# EAGLE design Hutschienenmoped_24V (EAGLE 9.6.2)
Assembly variants: ECU Type I non terminated, b

## Sheet 1 of 6
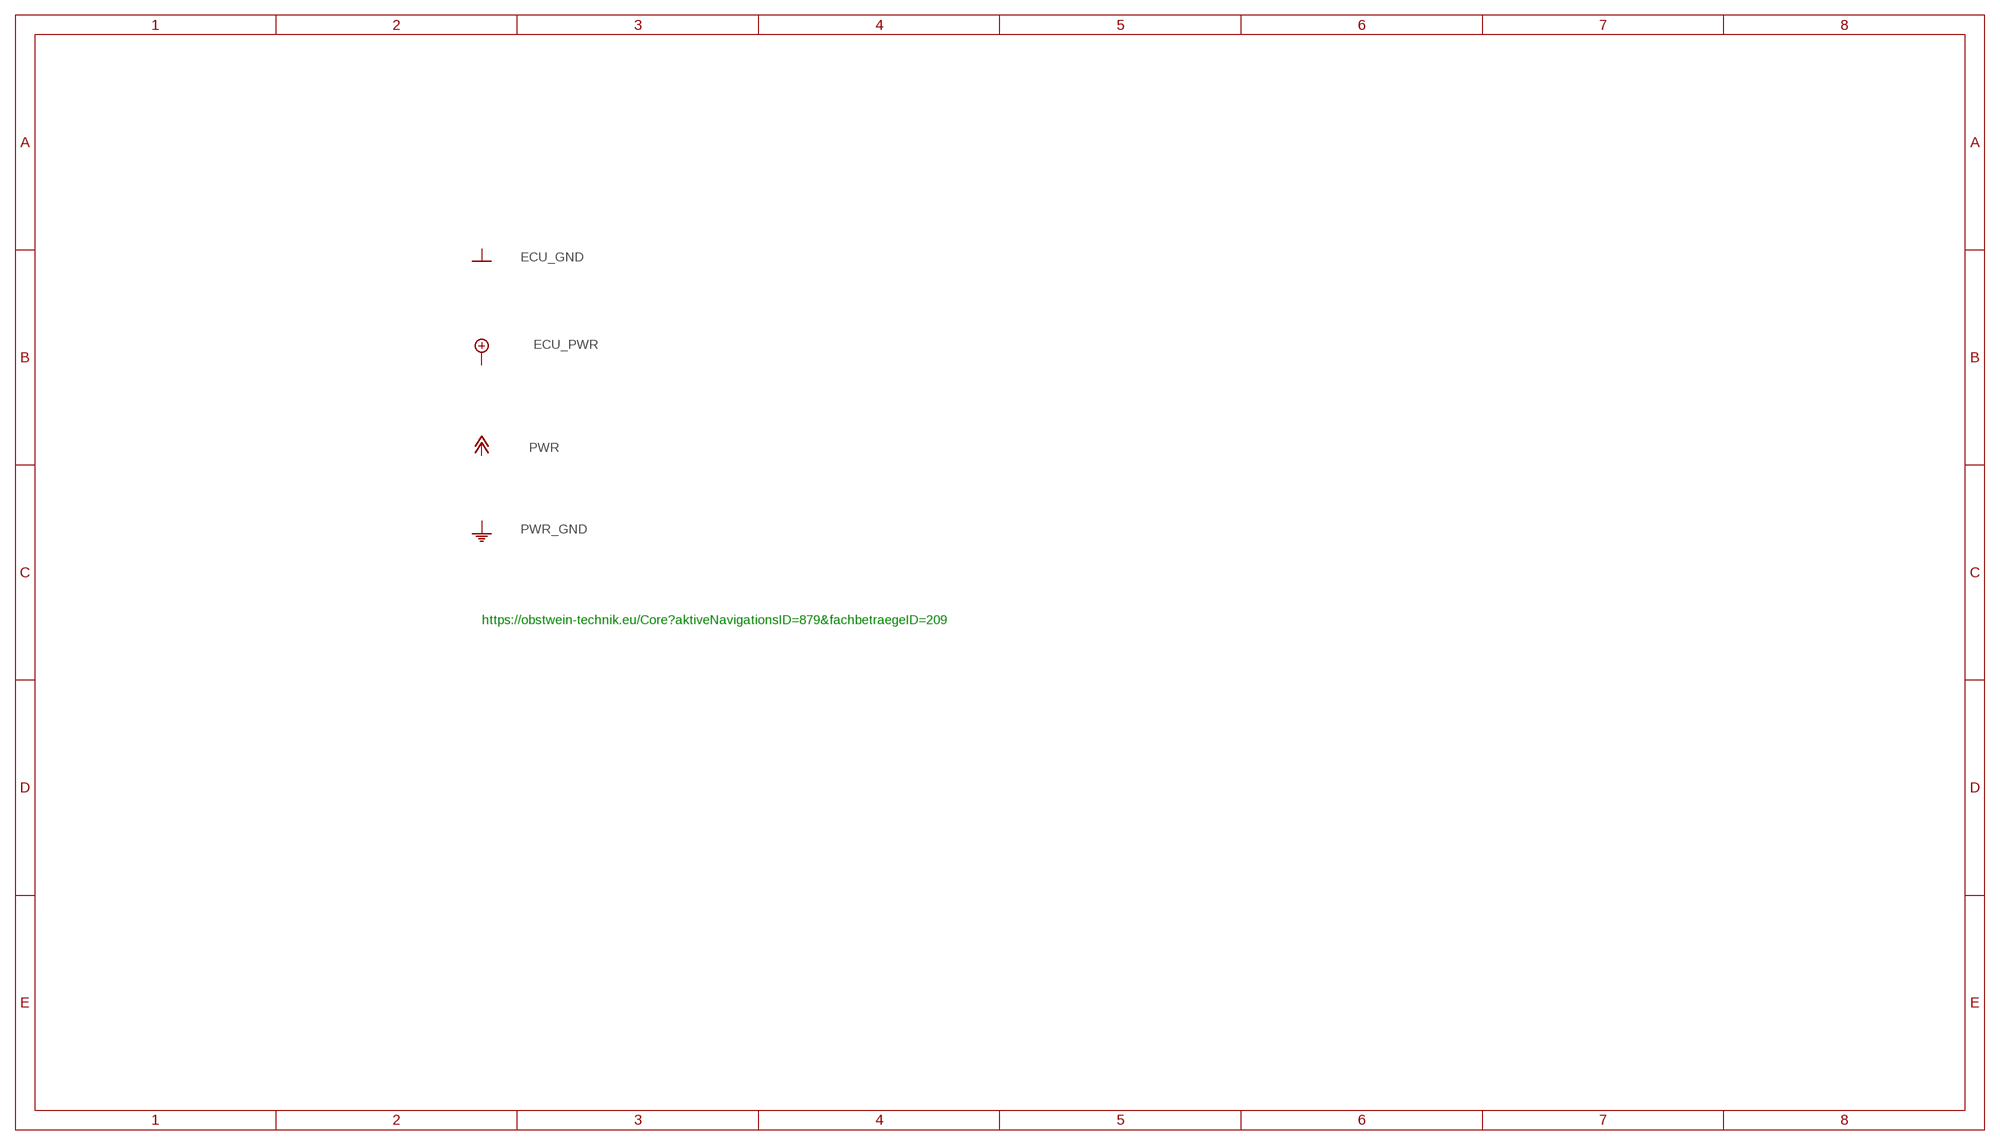
[diagram p0: schematic, sheet 1]

### Notes on the sheet
- https://obstwein-technik.eu/Core?aktiveNavigationsID=879&fachbetraegeID=209

## Sheet 2 of 6
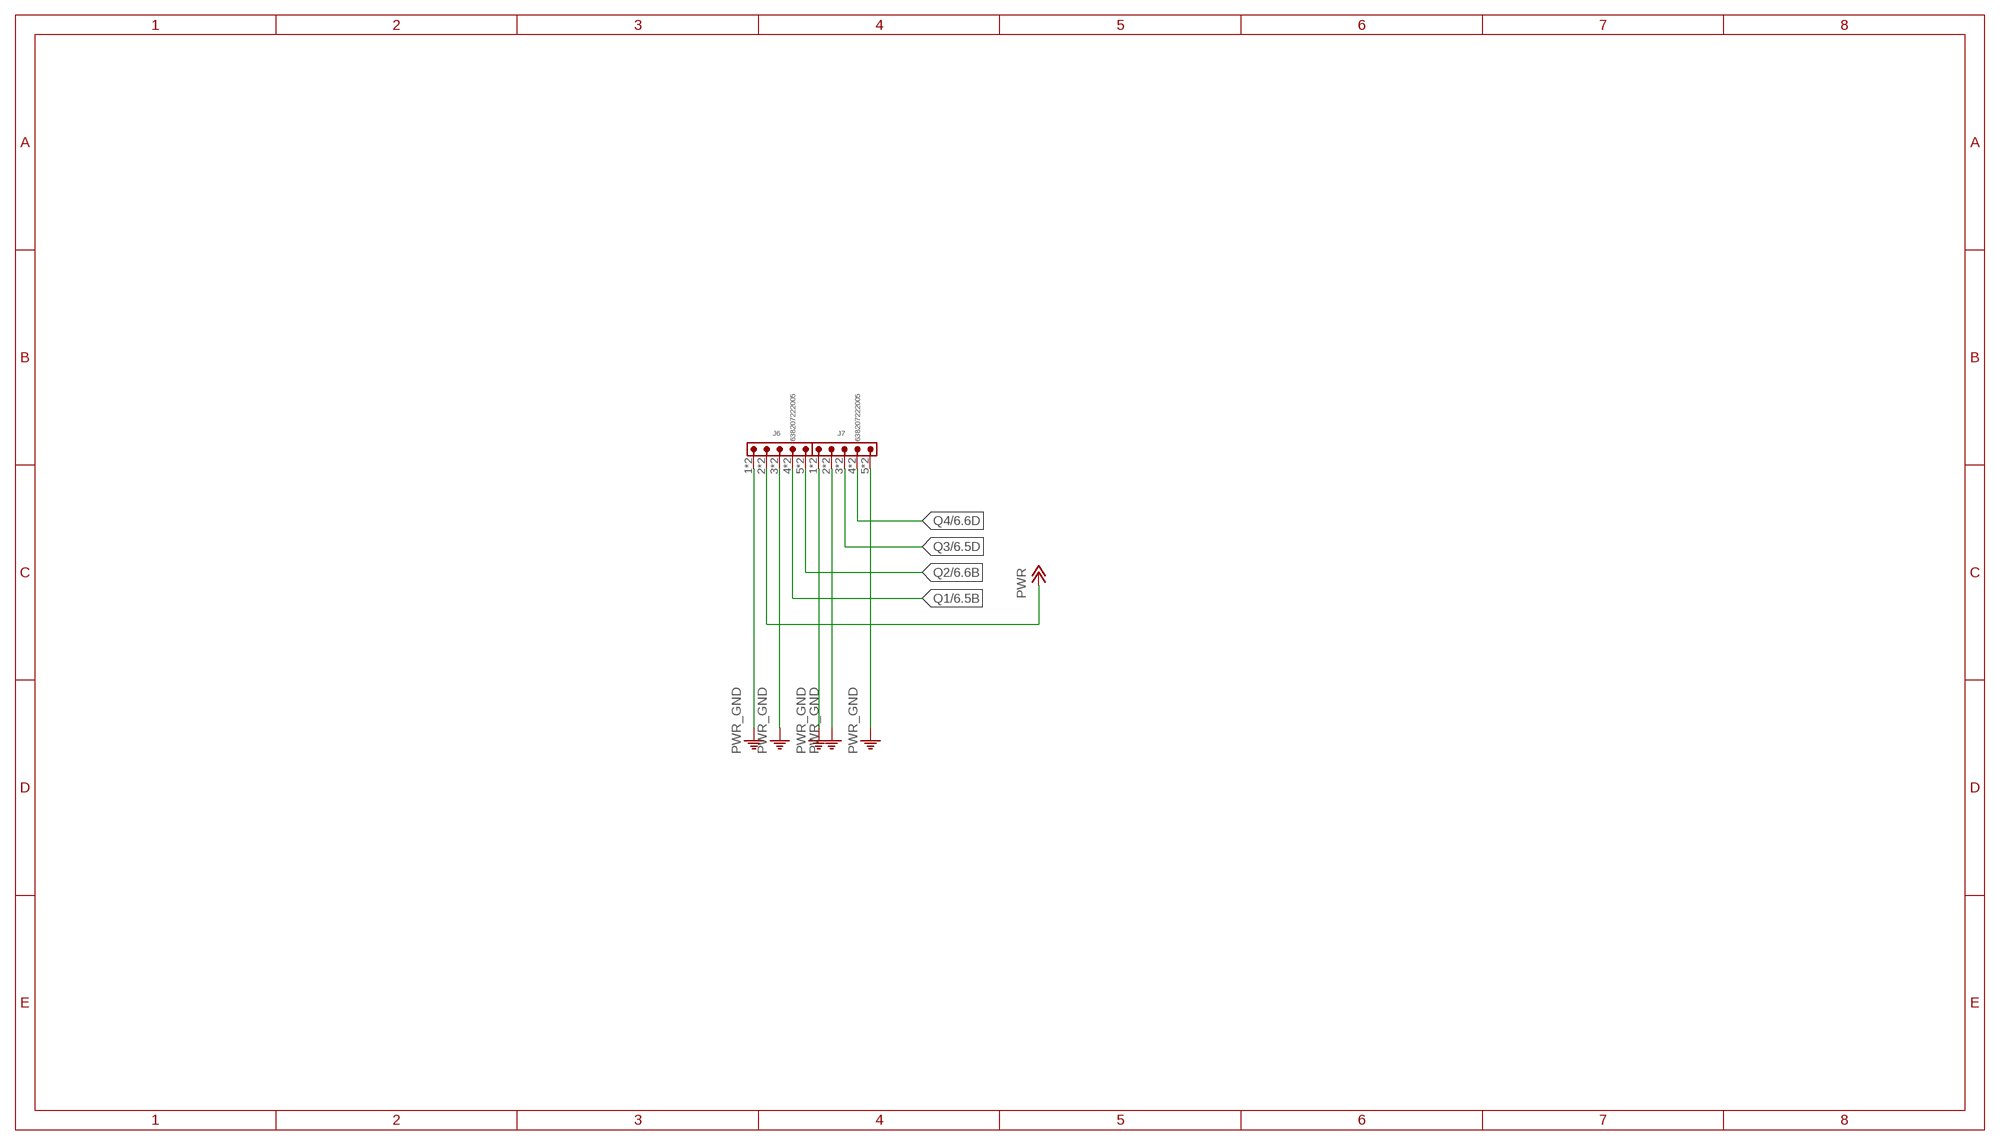
[diagram p1: schematic, sheet 2]

### Parts
J6  638207222005  638207222005  [638207222005]
J7  638207222005  638207222005  [638207222005]

### Nets
PWR: J6.2 J6.A2 ; also sheet 6
PWR_GND: J6.1 J6.3 J6.A1 J6.A3 J7.1 J7.2 J7.5 J7.A1 J7.A2 J7.A5 ; also sheet 6
Q1: J6.4 J6.A4 ; also sheet 6
Q2: J6.5 J6.A5 ; also sheet 6
Q3: J7.3 J7.A3 ; also sheet 6
Q4: J7.4 J7.A4 ; also sheet 6

## Sheet 3 of 6
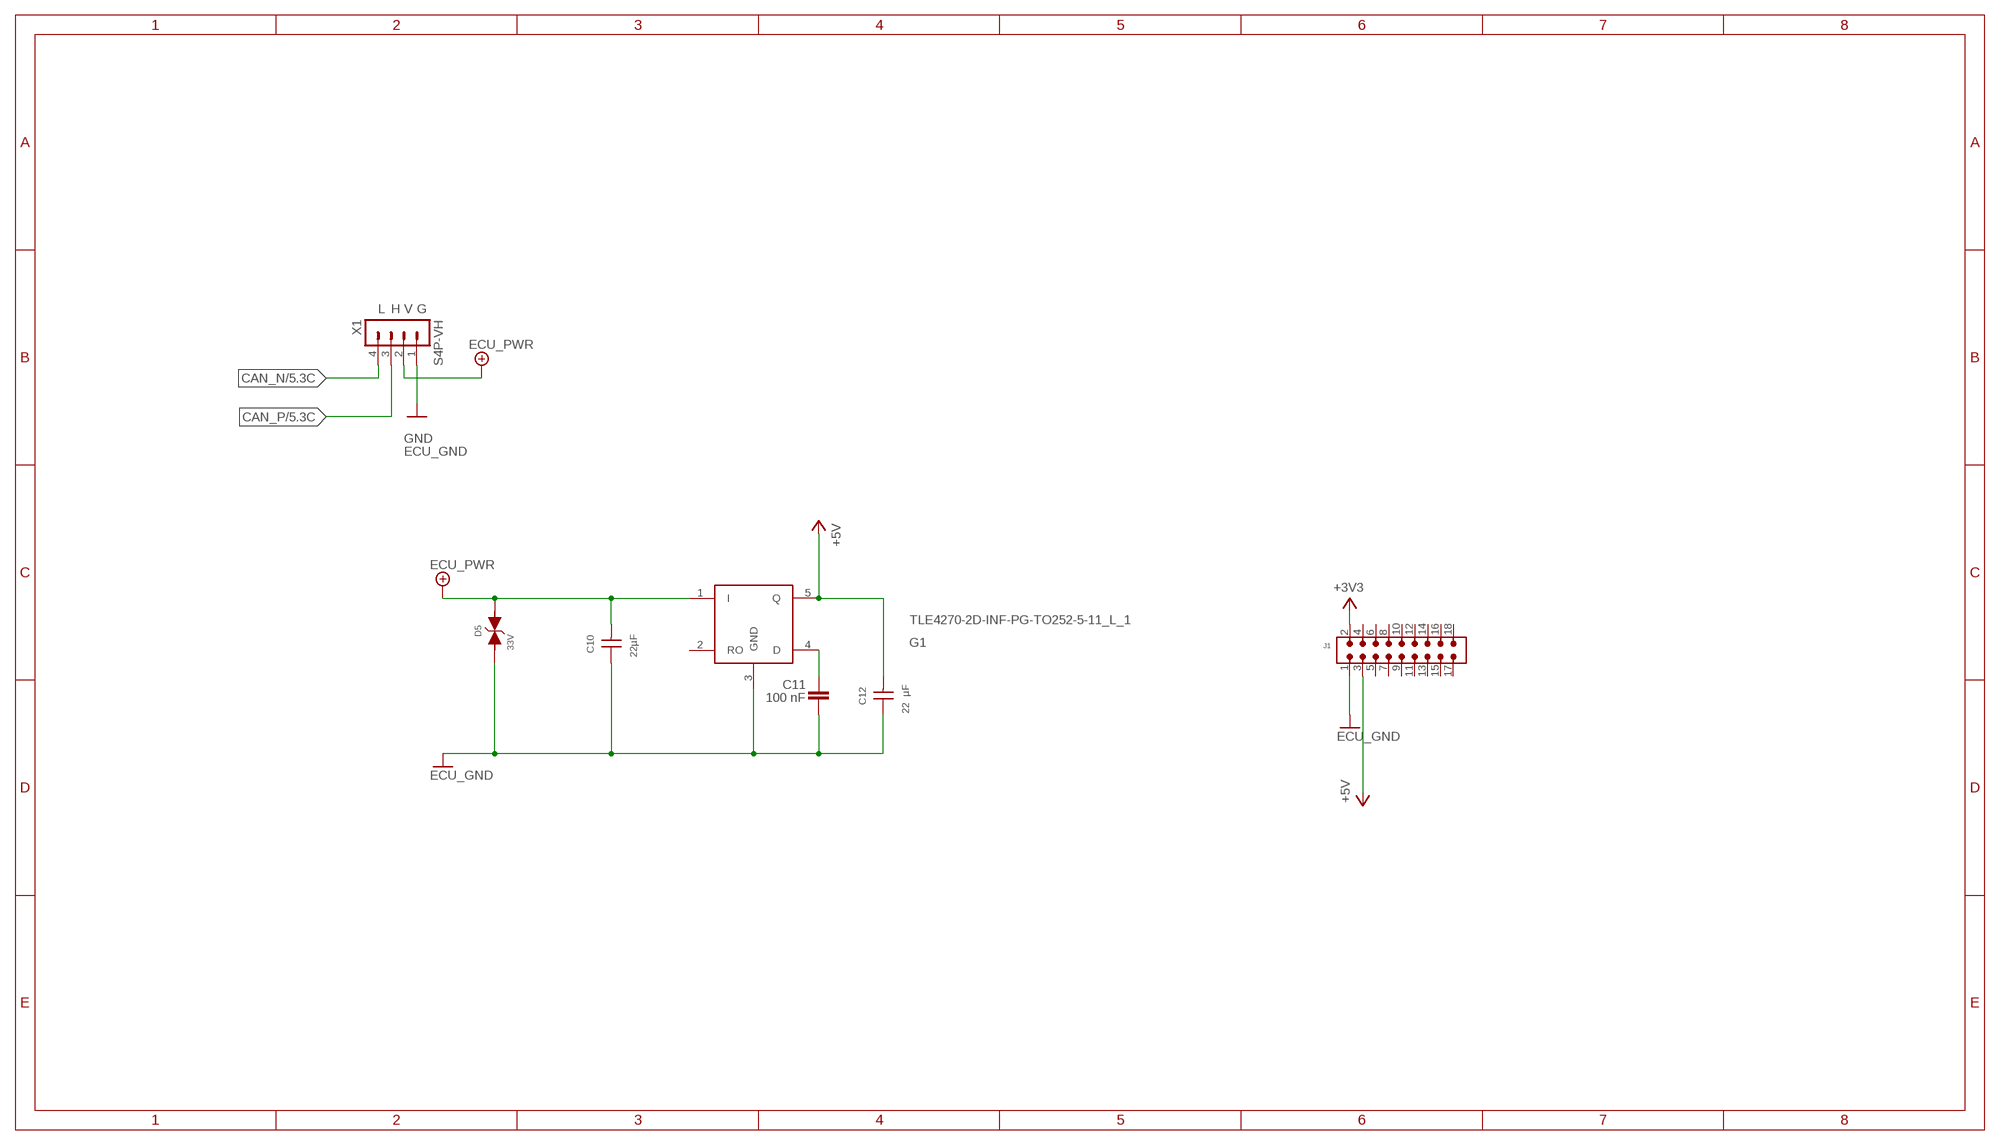
[diagram p2: schematic, sheet 3]

### Parts
C10  22µF  WCAP-CSGP_1210_H2.5_885012109014_25V(DC)  [WCAP-CSGP_1210_H2.5]
C11  100 nF  WCAP-CSGP_0402_885012205037_16V(DC)  [WCAP-CSGP_0402]
C12  22 µF  WCAP-CSGP_0805_H1.25_885012107011_10V(DC)  [WCAP-CSGP_0805_H1.25_R]
D5  33V  WE-TVSP_DO-214AB_3000W_BI_824551331  [WE-TVSP_DO-214AB_BIDIRECTIONAL]
G1  TLE4270-2D-INF-PG-TO252-5-11_L_1  [INF-PG-TO252-5-11_L_1PRIMARY]
J1  6130XX21121_61301821121  [61301821121]
X1  S4P-VH  [S4P-VH]

### Nets
+3V3: J1.2 ; also sheet 4,5
+5V: C12.2 G1.5(Q) J1.3 ; also sheet 4,5
CAN_N: X1.4 ; also sheet 5
CAN_P: X1.3 ; also sheet 5
ECU_GND [GND]: C10.1 C11.2 C12.1 D5.1 G1.3(GND) J1.1 X1.1 ; supply symbol labelled GND ; also sheet 4,5,6
ECU_PWR: C10.2 D5.2 G1.1(I) X1.2 ; also sheet 6
N$7: C11.1 G1.4(D)
Unconnected: G1.2(RO) J1.4 J1.5 J1.6 J1.7 J1.8 J1.9 J1.10 J1.11 J1.12 J1.13 J1.14 J1.15 J1.16 J1.17 J1.18

### Notes on the sheet
- L | H | V | G

## Sheet 4 of 6
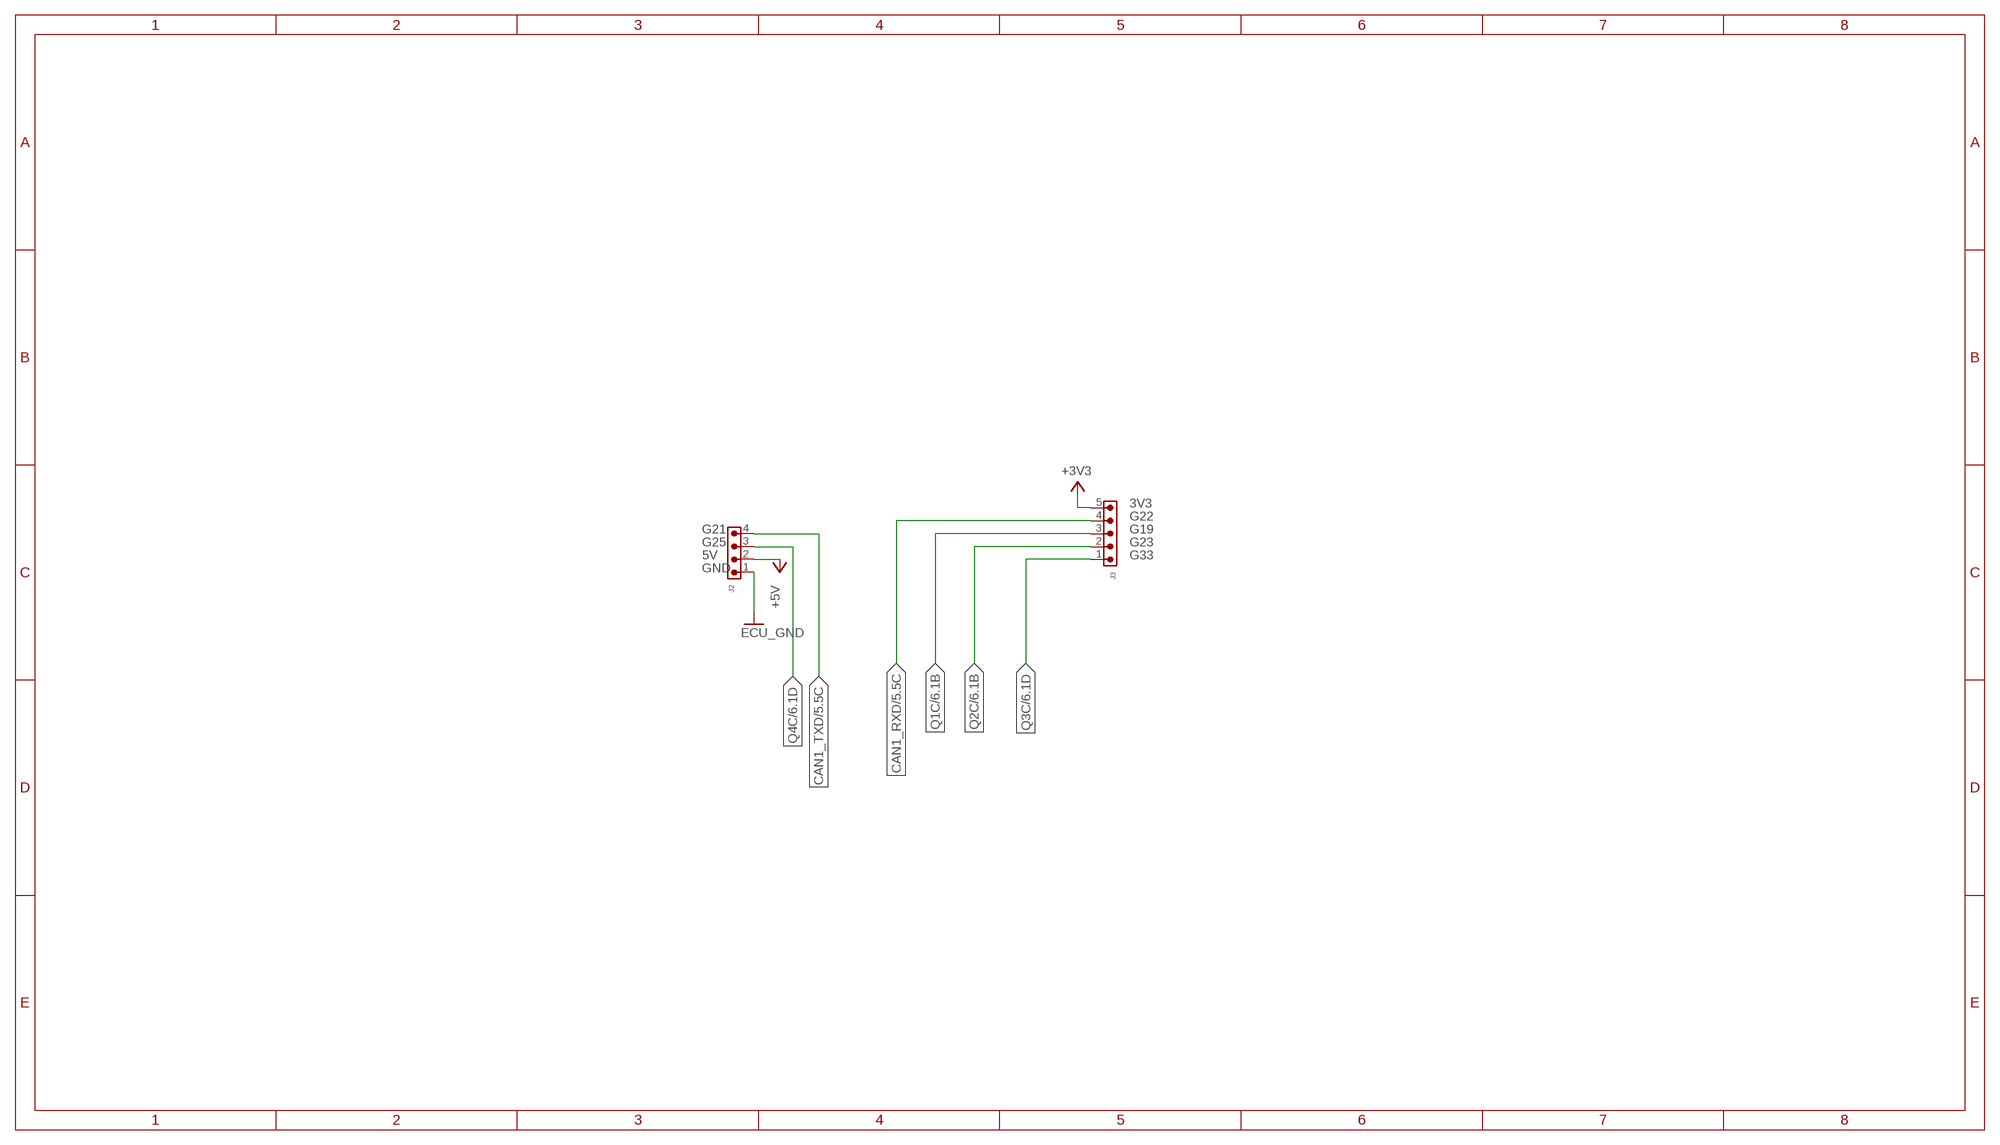
[diagram p3: schematic, sheet 4]

### Parts
J2  6130XX11121_61300411121  [61300411121]
J3  6130XX11121_61300511121  [61300511121]

### Nets
+3V3: J3.5 ; also sheet 3,5
+5V: J2.2 ; also sheet 3,5
CAN1_RXD: J3.4 ; also sheet 5
CAN1_TXD: J2.4 ; also sheet 5
ECU_GND [GND]: J2.1 ; also sheet 3,5,6
Q1C: J3.3 ; also sheet 6
Q2C: J3.2 ; also sheet 6
Q3C: J3.1 ; also sheet 6
Q4C: J2.3 ; also sheet 6

### Notes on the sheet
- 3V3
- G22
- G21 | G19
- G25 | G23
- 5V | G33
- GND

## Sheet 5 of 6
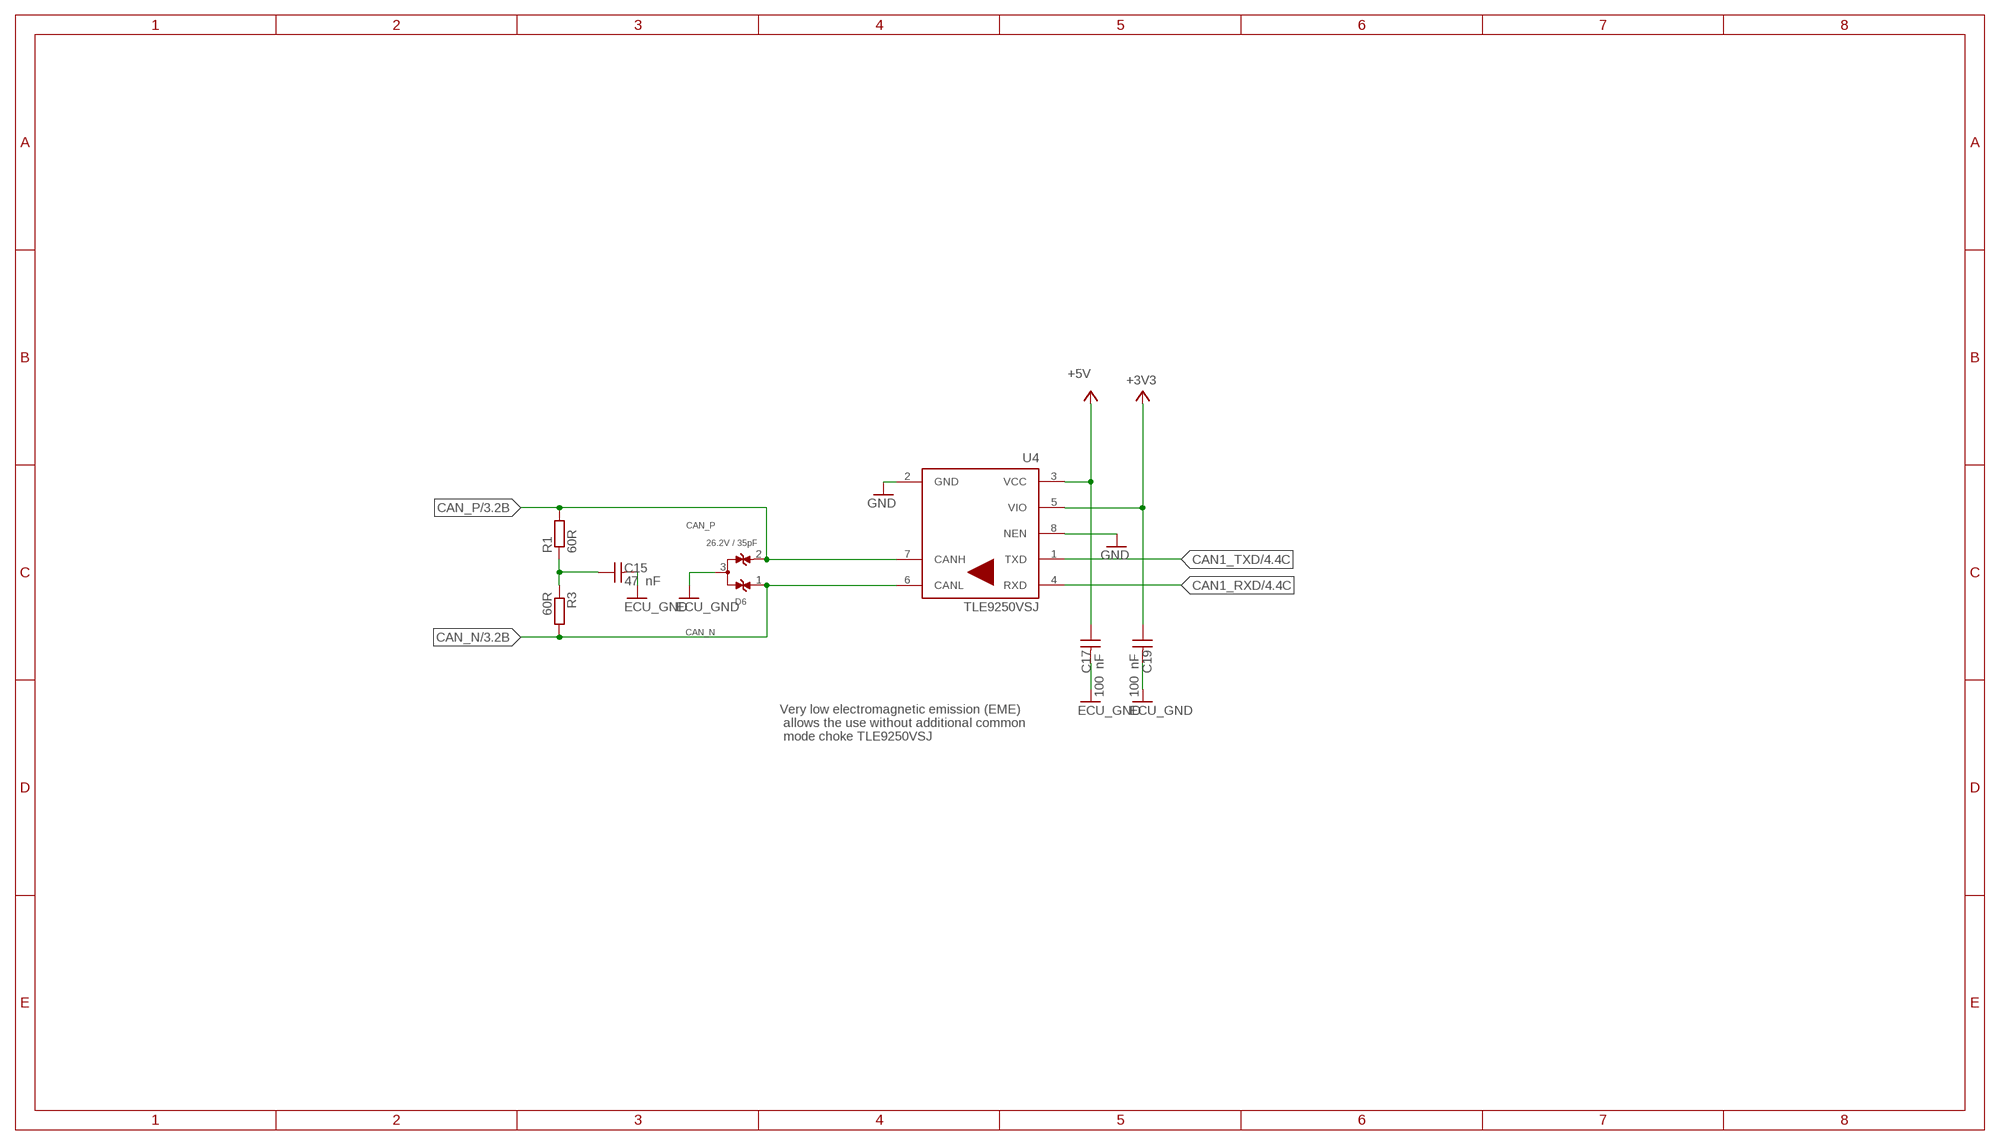
[diagram p4: schematic, sheet 5]

### Parts
C15  47 nF  WCAP-CSGP_0805_H0.8_885012207096_50V(DC)_R  [WCAP-CSGP_0805_H0.8_R]
C17  100 nF  WCAP-CSGP_0805_H0.8_885012207098_50V(DC)_R  [WCAP-CSGP_0805_H0.8_R]
C19  100 nF  WCAP-CSGP_0805_H0.8_885012207098_50V(DC)_R  [WCAP-CSGP_0805_H0.8_R]
D6  26.2V / 35pF  WE-TVS_SOT23-3L_824098024  [WE-TVS_SOT23-3L]
R1  60R  R-EU_R0805  [R0805]
R3  60R  R-EU_R0805  [R0805]
U4  TLE9250VSJ  [SOIC127P602X173-8N-V]

### Nets
+3V3: C19.1 U4.5(VIO) ; also sheet 3,4
+5V: C17.1 U4.3(VCC) ; also sheet 3,4
CAN1_RXD: U4.4(RXD) ; also sheet 4
CAN1_TXD: U4.1(TXD) ; also sheet 4
CAN_N: D6.1 R3.2 U4.6(CANL) ; also sheet 3
CAN_P: D6.2 R1.2 U4.7(CANH) ; also sheet 3
ECU_GND [GND]: C15.2 C17.2 C19.2 D6.3 U4.2(GND) U4.8(NEN) ; supply symbol labelled GND ; also sheet 3,4,6
N$17: C15.1 R1.1 R3.1

### Notes on the sheet
- Very low electromagnetic emission (EME)
   allows the use without additional common
   mode choke TLE9250VSJ

## Sheet 6 of 6
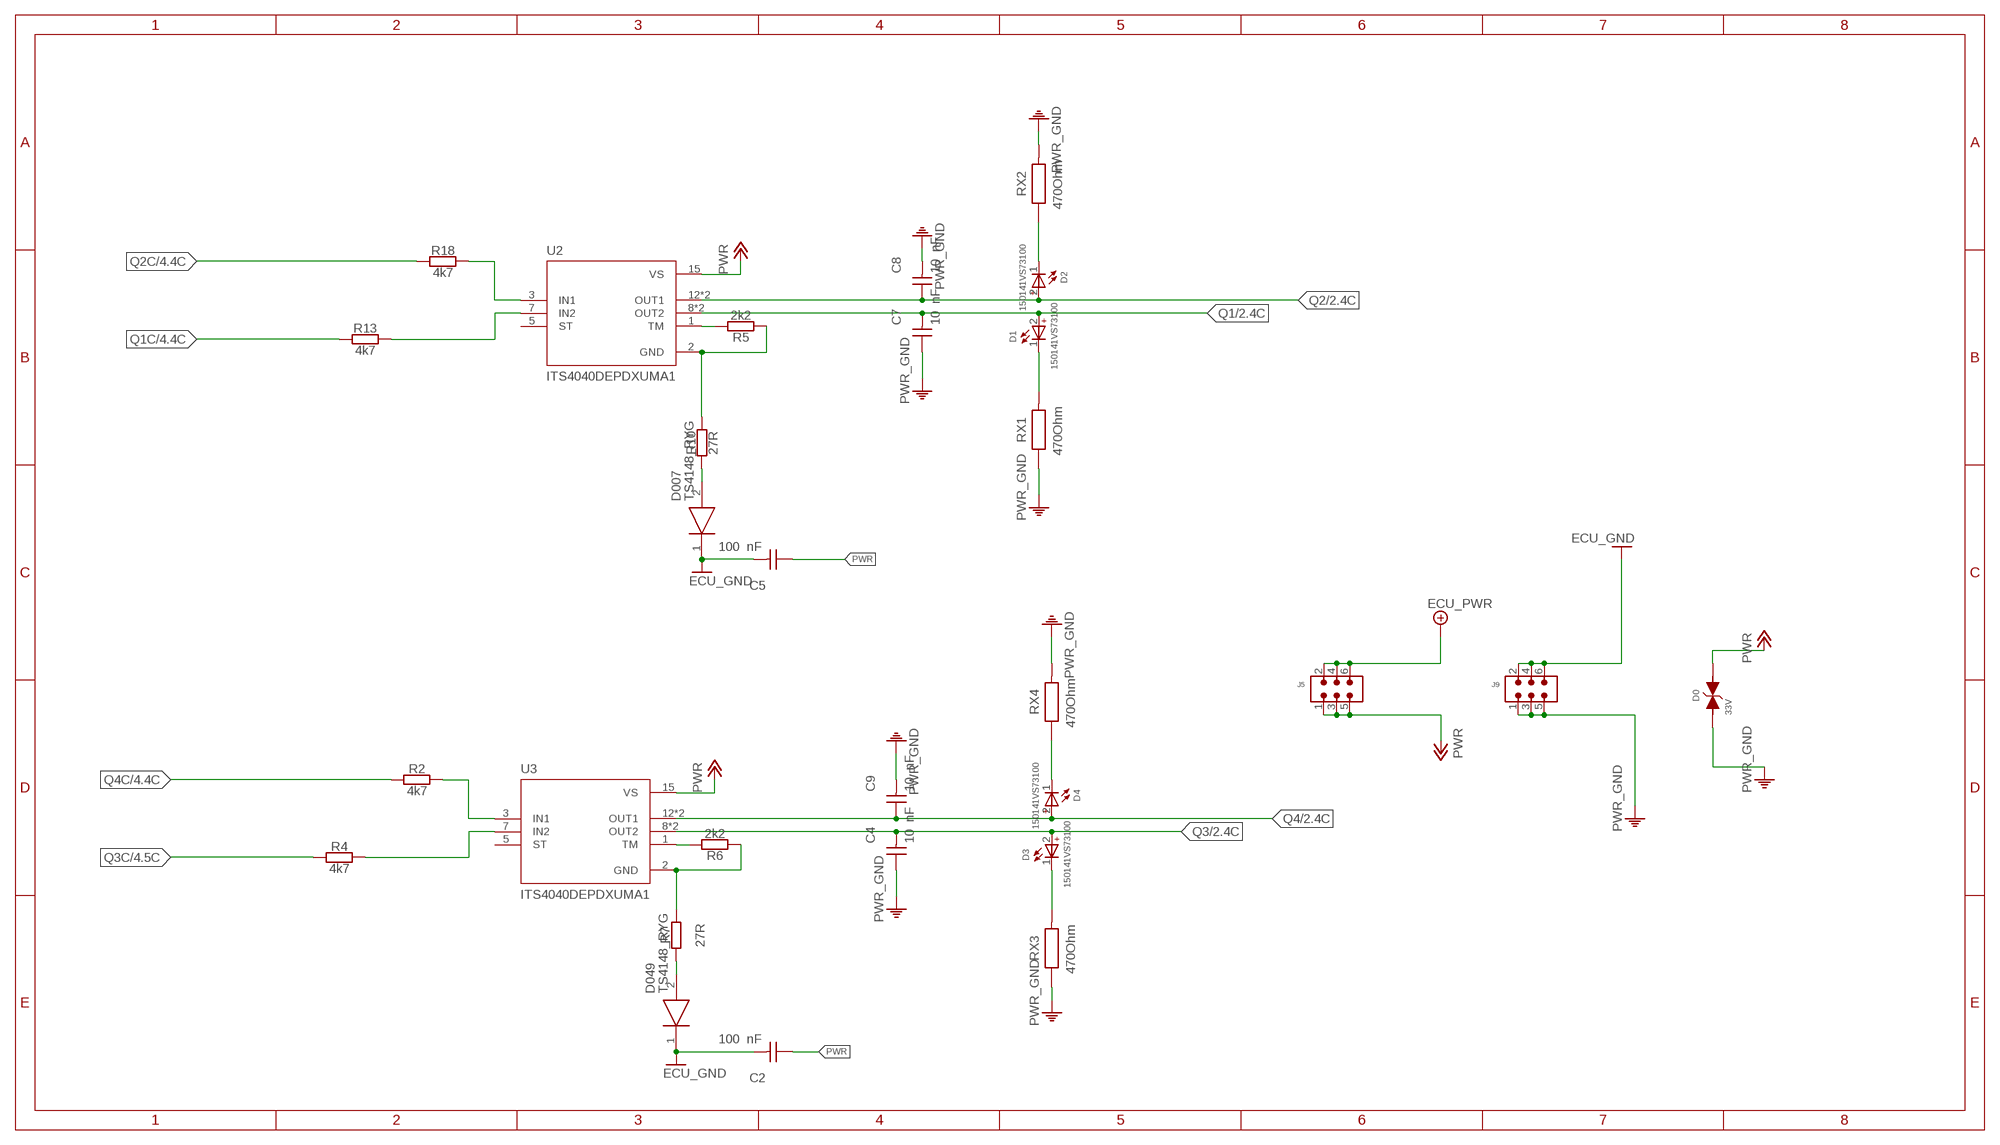
[diagram p5: schematic, sheet 6]

### Parts
C2  100 nF  WCAP-CSGP_0805_H0.8_885012207098_50V(DC)_R  [WCAP-CSGP_0805_H0.8_R]
C4  10 nF  WCAP-CSGP_0805_H0.8_885012207092_50V(DC)_R  [WCAP-CSGP_0805_H0.8_R]
C5  100 nF  WCAP-CSGP_0805_H0.8_885012207098_50V(DC)_R  [WCAP-CSGP_0805_H0.8_R]
C7  10 nF  WCAP-CSGP_0805_H0.8_885012207092_50V(DC)_R  [WCAP-CSGP_0805_H0.8_R]
C8  10 nF  WCAP-CSGP_0805_H0.8_885012207092_50V(DC)_R  [WCAP-CSGP_0805_H0.8_R]
C9  10 nF  WCAP-CSGP_0805_H0.8_885012207092_50V(DC)_R  [WCAP-CSGP_0805_H0.8_R]
D0  33V  WE-TVSP_DO-214AB_3000W_BI_824551331  [WE-TVSP_DO-214AB_BIDIRECTIONAL]
D1  150141VS73100  WL-SMTW_3528_150141VS73100  [WL-SMTW_3528]
D2  150141VS73100  WL-SMTW_3528_150141VS73100  [WL-SMTW_3528]
D3  150141VS73100  WL-SMTW_3528_150141VS73100  [WL-SMTW_3528]
D4  150141VS73100  WL-SMTW_3528_150141VS73100  [WL-SMTW_3528]
D007  TS4148_RYG  [DIOC2012X95N]
D049  TS4148_RYG  [DIOC2012X95N]
J5  6130XX21121_61300621121  [61300621121]
J9  6130XX21121_61300621121  [61300621121]
R2  4k7  R-EU_R0805  [R0805]
R4  4k7  R-EU_R0805  [R0805]
R5  2k2  R-EU_R0805  [R0805]
R6  2k2  R-EU_R0805  [R0805]
R7  27R  R-EU_R0805  [R0805]
R10  27R  R-EU_R0805  [R0805]
R13  4k7  R-EU_R0805  [R0805]
R18  4k7  R-EU_R0805  [R0805]
RX1  470Ohm  WRIS-KWKB_0612_561020132023  [WRIS-KWKB_0612]
RX2  470Ohm  WRIS-KWKB_0612_561020132023  [WRIS-KWKB_0612]
RX3  470Ohm  WRIS-KWKB_0612_561020132023  [WRIS-KWKB_0612]
RX4  470Ohm  WRIS-KWKB_0612_561020132023  [WRIS-KWKB_0612]
U2  ITS4040DEPDXUMA1  [SOP65P600X115-15N]
U3  ITS4040DEPDXUMA1  [SOP65P600X115-15N]

### Nets
ECU_GND [GND]: C2.2 C5.2 D007.1(K) D049.1(K) J9.2 J9.4 J9.6 ; also sheet 3,4,5
ECU_PWR: J5.2 J5.4 J5.6 ; also sheet 3
N$1 [GND]: D4.1(-) RX4.1
N$2: R2.2 U3.3(IN1)
N$3: R6.2 U3.1(TM)
N$4: R4.2 U3.7(IN2)
N$5: R5.2 U2.1(TM)
N$6 [GND]: D2.1(-) RX2.1
N$8 [GND]: D1.1(-) RX1.2
N$9 [GND]: D3.1(-) RX3.2
N$10: R18.2 U2.3(IN1)
N$11 [GND]: D049.2(A) R7.1
N$12: D007.2(A) R10.1
N$13: R6.1 R7.2 U3.2(GND)
N$14: R13.2 U2.7(IN2)
N$15: R5.1 R10.2 U2.2(GND)
PWR: C2.1 C5.1 D0.2 J5.1 J5.3 J5.5 U2.15(VS) U3.15(VS) ; also sheet 2
PWR_GND: C4.1 C7.1 C8.2 C9.2 D0.1 J9.1 J9.3 J9.5 RX1.1 RX2.2 RX3.1 RX4.2 ; also sheet 2
Q1: C7.2 D1.2(+) U2.8(OUT2) U2.10(OUT2) ; also sheet 2
Q1C: R13.1 ; also sheet 4
Q2: C8.1 D2.2(+) U2.12(OUT1) U2.14(OUT1) ; also sheet 2
Q2C: R18.1 ; also sheet 4
Q3: C4.2 D3.2(+) U3.8(OUT2) U3.10(OUT2) ; also sheet 2
Q3C: R4.1 ; also sheet 4
Q4: C9.1 D4.2(+) U3.12(OUT1) U3.14(OUT1) ; also sheet 2
Q4C: R2.1 ; also sheet 4
Unconnected: U2.5(ST) U3.5(ST)

## Library data of the parts
C2 C5 C17 C19 = Wurth_Capacitors_WCAP-CSGP:WCAP-CSGP_0805_H0.8: WCAP-CSGP MLCCs 0805 General Purpose Characteristics General purpose product series High performance ceramic High electrical precision and stability ceramic especially for NP0 Minimal aging especially for NP0 Mounting style: SMT-Chip Ceramic: NP0 (Class I), X5R (Class II), X7R (Class II) Capacitance range: 1 pF ‒ 47 μF Temperature Coefficient: ±30 ppm/°C; ±0.54 % for NP0 ±15 % for X7R and X5R Voltage range (UR): 6.3 ‒ 100 V(DC) Operating temperature: -55 °C up to + 125 °C for NP0 and X7R -55 °C up to + 85 °C for X5R Termination: Cu/Ni/Sn Recommended soldering: Reflow soldering Wave soldering (only valid for the thickness ≤1.00 mm) for NP0 and X7R Applications TTemperature compensation (NP0) Coupling Decoupling Bypass Smoothing Filtering Resonant circuit <https://www.we-online.com/catalog/media/o166500v209%20Family_WE-MLCC_0805_grau.jpg> Details see: https://www.we-online.com/catalog/en/WCAP-CSGP-0805/ Updated by yingchun,Shan;2020-03-09 2020(C) Würth Elektronik; CERAMIC-TYPE: X7R Class II; DATASHEET-URL: https://www.we-online.com/catalog/datasheet/885012207098.pdf; DF: 0.025; H: 0.8mm; OPERATING-TEMPERATURE: -55 °C up to +125 °C; PART-NUMBER: 885012207098; QMIN: -; RISO: 5GOhm; TECHNICAL-REFERENCE: X7R0805104K050DFCT10000; TOL-VALUE: ±10%; VR: 50V(DC)
C4 C7-C9 = Wurth_Capacitors_WCAP-CSGP:WCAP-CSGP_0805_H0.8: WCAP-CSGP MLCCs 0805 General Purpose Characteristics General purpose product series High performance ceramic High electrical precision and stability ceramic especially for NP0 Minimal aging especially for NP0 Mounting style: SMT-Chip Ceramic: NP0 (Class I), X5R (Class II), X7R (Class II) Capacitance range: 1 pF ‒ 47 μF Temperature Coefficient: ±30 ppm/°C; ±0.54 % for NP0 ±15 % for X7R and X5R Voltage range (UR): 6.3 ‒ 100 V(DC) Operating temperature: -55 °C up to + 125 °C for NP0 and X7R -55 °C up to + 85 °C for X5R Termination: Cu/Ni/Sn Recommended soldering: Reflow soldering Wave soldering (only valid for the thickness ≤1.00 mm) for NP0 and X7R Applications TTemperature compensation (NP0) Coupling Decoupling Bypass Smoothing Filtering Resonant circuit <https://www.we-online.com/catalog/media/o166500v209%20Family_WE-MLCC_0805_grau.jpg> Details see: https://www.we-online.com/catalog/en/WCAP-CSGP-0805/ Updated by yingchun,Shan;2020-03-09 2020(C) Würth Elektronik; CERAMIC-TYPE: X7R Class II; DATASHEET-URL: https://www.we-online.com/catalog/datasheet/885012207092.pdf; DF: 0.025; H: 0.8mm; OPERATING-TEMPERATURE: -55 °C up to +125 °C; PART-NUMBER: 885012207092; QMIN: -; RISO: 10GOhm; TECHNICAL-REFERENCE: X7R0805103K050DFCT10000; TOL-VALUE: ±10%; VR: 50V(DC)
C10 = Wurth_Capacitors_WCAP-CSGP:WCAP-CSGP_1210_H2.5: WCAP-CSGP MLCCs 1210 General Purpose Characteristics General purpose product series High performance ceramic High electrical precision and stability ceramic especially for NP0 Minimal aging especially for NP0 Mounting style: SMT-Chip Ceramic: NP0 (Class I), X5R (Class II), X7R (Class II) Capacitance range: 22 pF ‒ 100 µF Temperature Coefficient: ±30 ppm/°C; ±0.54 % for NP0 ±15 % for X7R and X5R Voltage range (UR): 6.3 ‒ 100 V(DC) Operating temperature: -55 °C up to + 125 °C for NP0 and X7R -55 °C up to + 85 °C for X5R Termination: Cu/Ni/Sn Recommended soldering: Reflow soldering Applications Temperature compensation (NP0) Coupling Decoupling Bypass Smoothing Filtering Resonant circuit <https://www.we-online.com/catalog/media/o166502v209%20Family_WE-MLCC_1210.jpg> Details see: https://www.we-online.com/catalog/en/WCAP-CSGP-1210/ Updated by yingchun,Shan;2020-03-09 2020(C) Würth Elektronik; CERAMIC-TYPE: X5R Class II; DATASHEET-URL: https://www.we-online.com/catalog/datasheet/885012109014.pdf; DF: 0.05; H: 2.5mm; OPERATING-TEMPERATURE: -55 °C up to +85 °C; PART-NUMBER: 885012109014; QMIN: -; RISO: 0,005G Ohm; TECHNICAL-REFERENCE: X5R1210226M025DFCT10000; TOL-VALUE: ±20%; VR: 25V(DC)
C11 = fliegl-wuerth:WCAP-CSGP_0402: WCAP-CSGP MLCCs 0402 General Purpose Characteristics High performance ceramic High electrical precision and stability ceramic especially for NP0 Minimal aging especially for NP0 Mounting style: SMT-Chip Ceramic: NP0 (Class I), X5R (Class II), X7R (Class II) Capacitance range: 1 pF ‒ 10 µF Temperature Coefficient: ±30 ppm/°C; ±0.54 % for NP0 ±15 % for X5R and X7R Voltage range (UR): 6.3 ‒ 100 V(DC) Operating temperature: -55 °C up to + 125 °C for NP0 and X7R -55 °C up to + 85 °C for X5R Termination: Cu/Ni/Sn Recommended soldering: Reflow soldering Applications Temperature compensation (NP0) Coupling Decoupling Bypass Smoothing Filtering Resonant circuit <https://www.we-online.com/catalog/media/o157810v209%20Family_WE-MLCC_0805_weiss.jpg> Details see: https://www.we-online.com/catalog/en/WCAP-CSGP-0402/ Updated by yingchun,Shan;2020-03-06 2020(C) Würth Elektronik; ARTIKEL_NR: 545504; CERAMIC-TYPE: X7R Class II; PART-NUMBER: 885012205037; TOL-VALUE: ±10%; VR: 16V(DC)
C12 = Wurth_Capacitors_WCAP-CSGP:WCAP-CSGP_0805_H1.25: WCAP-CSGP MLCCs 0805 General Purpose Characteristics General purpose product series High performance ceramic High electrical precision and stability ceramic especially for NP0 Minimal aging especially for NP0 Mounting style: SMT-Chip Ceramic: NP0 (Class I), X5R (Class II), X7R (Class II) Capacitance range: 1 pF ‒ 47 μF Temperature Coefficient: ±30 ppm/°C; ±0.54 % for NP0 ±15 % for X7R and X5R Voltage range (UR): 6.3 ‒ 100 V(DC) Operating temperature: -55 °C up to + 125 °C for NP0 and X7R -55 °C up to + 85 °C for X5R Termination: Cu/Ni/Sn Recommended soldering: Reflow soldering Wave soldering (only valid for the thickness ≤1.00 mm) for NP0 and X7R Applications TTemperature compensation (NP0) Coupling Decoupling Bypass Smoothing Filtering Resonant circuit <https://www.we-online.com/catalog/media/o166500v209%20Family_WE-MLCC_0805_grau.jpg> Details see: https://www.we-online.com/catalog/en/WCAP-CSGP-0805/ Updated by Ella Wu 2021-02-03 2021(C) Würth Elektronik; CERAMIC-TYPE: X5R Class II; DATASHEET-URL: https://www.we-online.com/catalog/datasheet/885012107011.pdf; DF: 0.1; H: 1.25mm; OPERATING-TEMPERATURE: -55 °C up to +85 °C; PART-NUMBER: 885012107011; QMIN: -; RISO: 0,005GOhm; TECHNICAL-REFERENCE: X5R0805226M010DFCT10000; TOL-VALUE: ±20%; VR: 10V(DC)
C15 = Wurth_Capacitors_WCAP-CSGP:WCAP-CSGP_0805_H0.8: WCAP-CSGP MLCCs 0805 General Purpose Characteristics General purpose product series High performance ceramic High electrical precision and stability ceramic especially for NP0 Minimal aging especially for NP0 Mounting style: SMT-Chip Ceramic: NP0 (Class I), X5R (Class II), X7R (Class II) Capacitance range: 1 pF ‒ 47 μF Temperature Coefficient: ±30 ppm/°C; ±0.54 % for NP0 ±15 % for X7R and X5R Voltage range (UR): 6.3 ‒ 100 V(DC) Operating temperature: -55 °C up to + 125 °C for NP0 and X7R -55 °C up to + 85 °C for X5R Termination: Cu/Ni/Sn Recommended soldering: Reflow soldering Wave soldering (only valid for the thickness ≤1.00 mm) for NP0 and X7R Applications TTemperature compensation (NP0) Coupling Decoupling Bypass Smoothing Filtering Resonant circuit <https://www.we-online.com/catalog/media/o166500v209%20Family_WE-MLCC_0805_grau.jpg> Details see: https://www.we-online.com/catalog/en/WCAP-CSGP-0805/ Updated by yingchun,Shan;2020-03-09 2020(C) Würth Elektronik; CERAMIC-TYPE: X7R Class II; DATASHEET-URL: https://www.we-online.com/catalog/datasheet/885012207096.pdf; DF: 0.025; H: 0.8mm; OPERATING-TEMPERATURE: -55 °C up to +125 °C; PART-NUMBER: 885012207096; QMIN: -; RISO: 10GOhm; TECHNICAL-REFERENCE: X7R0805473K050DFCT10000; TOL-VALUE: ±10%; VR: 50V(DC)
D0 D5 = Wurth_EMC Components_WE-TVSP:WE-TVSP_DO-214AB_3000W_BI: WE-TVSP Power TVS Diode Characteristics Low Profile Package Glass passivated Juction Excellent clamping capability Fast response time MSL Level 1, per J-STD-020 Classification of the plastic case: UL 94 V-0 Safety certification UL 497B, E478010 Identical design: - DO-214AC = SMAJ - DO-214AA = SMBJ - DO-214AB = SMCJ/SMDJ Applications Ideal to protect the I/O Interfaces, Bus Voltage and other circuits of sensetive electronic equipment against voltage transiensts <https://www.we-online.com/catalog/media/o55793v209%20WE-TVSP_600W-3000W_D0214AA_4C.jpg> Details see: https://www.we-online.com/catalog/en/WE-TVSP/ Updated by Ella Wu 2020-07-20 2020 (C) Würth Elektronik; DATASHEET-URL: https://www.we-online.com/catalog/datasheet/824551331.pdf; IPEAK: 56.3A; MOUNT: SMT; PART-NUMBER: 824551331; PDISS: 3000W; VBR: 38.65V; VCLAMP: 53.3V
D1-D4 = Wurth_LEDs_WL-SMTW:WL-SMTW_3528: WL-SMTW SMT Mono-color TOP LED Waterclear Characteristics Low energy consumption High reliability Low current requirement Fast switching No UV/IR radiation Slim Miniature size Flexibility in design Top view LED PLCC 2 white package Compact package outline, ideal for miniature applications Variety of colors Applications Signage and indirect illumination Flat lamp Indicator and backlight in telecommunication Consumer application: dash-board, telephone or A/V equipments Flat backlight for LCDs, switches and symbols Optical indicators Indoor and outdoor displays Scanner Backlight in LCD, cellular phones, switches, keys, displays lluminated advertising, panel Lighting device: indicator, general lighting Camera flash, hand carrier flash Coupling into light guides <https://www.we-online.com/catalog/media/o14908v209%20WL-SMTW_150285BSxxx.jpg> Details see: https://www.we-online.com/catalog/en/WL-SMTW/ Updated by Yingchun Shan,2020-03-20 2020(C) Wurth Elektronik; CHIP-TECHNOLOGY: AlInGaP; DATASHEET-URL: https://www.we-online.com/catalog/datasheet/150141VS73100.pdf; EMITTING-COLOR: Bright Green; I-V-TYP: 90mcd; LAMDA-DOM-TYP: 570nm; LAMDA-PEAK-TYP: 572nm; PART-NUMBER: 150141VS73100; PHI-V-TYP: -; V-F-TYP: 2V; VIEWING-ANGLE: 120°
D6 = fliegl-wuerth:WE-TVS_SOT23-3L_824098024: WE-TVS TVS Diode  Standard Series Characteristics Fast turn-on Low clamping voltage High ESD withstand voltage Uni- or bidirectional protection Small package Epoxy flame resistant UL94 V-0 Applications DC power supply USB Power Delivery (PD) Headsets and accessories PDAs Digital cameras MP3-Player Touch Panels Notebooks ESD, EFT and Surge Protection ESD protection in accordance with EN 61000-4-2  8 kV contact discharge  15 kV air discharge Application Notes ANP024 The USB Interface from EMC Point of View <https://katalog.we-online.de/media/images/v2/Family_WE-TVS_Standard.jpg> Details see: https://katalog.we-online.de/en/pbs/WE-TVS/82402374?m Created By Yingchun,Shan 2018-11-16 2018 (C) Wurth Elektronik; ARTIKEL_NR: 531887; KOMPONENTENNUMMER: 617684; WE-NUMBER: 824098024
D007 D049 = TS4148_RYG:TS4148_RYG: TAIWAN SEMICONDUCTOR - TS4148 RYG - DIODE, SMALL SIGNAL, 75V, 0.15A, 0805 Source: Datasheet <https://componentsearchengine.com/Datasheets/2/TS4148 RYG.pdf>; ALLIED_NUMBER: 70439260; ALLIED_PRICE-STOCK: https://www.alliedelec.com/taiwan-semiconductor-ts4148-ryg/70439260/; DESCRIPTION: TAIWAN SEMICONDUCTOR - TS4148 RYG - DIODE, SMALL SIGNAL, 75V, 0.15A, 0805; HEIGHT: 0.95mm; MANUFACTURER_NAME: Taiwan Semiconductor; MANUFACTURER_PART_NUMBER: TS4148 RYG; MOUSER_PART_NUMBER: 821-TS4148RYG; MOUSER_PRICE-STOCK: https://www.mouser.com/Search/Refine.aspx?Keyword=821-TS4148RYG
G1 = INF-PG-TO252-5-11L:TLE4270-2D-INF-PG-TO252-5-11_L_1
J1 = Wurth_Connectors_WR-PHD:6130XX21121_61301821121: WR-PHD 2.54 mm THT Dual Pin Header ARTICLE PROPERTIES: Pins:4;​ 6;​ 8;​ 10;​ 12;​ 14;​ 16;​ 18;​ 20;​ 22;​ 24;​ 26;​ 28;​ 30;​ 32;​ 34;​ 36;​ 40;​ 44;​ 64;​ 72;​ 80 KIND PROPERTIES: Pitch：2.54 mm Quality Class:3 as per CECC 75 301-802 Rows：Dual Gender：Pin Header Type：Board Stacker MATERIAL PROPERTIES: Insulator Material :PA6T Insulator Flammability Rating:UL94 V-0 Contact Material:Copper Alloy Contact Plating:Gold Contact Type:Stamped GENERAL INFORMATION Operating Temperature:-40 up to +105 °C Compliance:Lead free / RoHS ELECTRICAL PROPERTIES: Rated Current:3 A IR 1:3 A Withstanding Voltage:500 V (AC) Contact Resistance:20 mΩ RISO:1000 MΩ CERTIFICATION UL Approval:E323964 PACKAGING PROPERTIES Packaging:Bag <https://katalog.we-online.com/media/images/v2/o33215v209%20Family_WR-PHD_6130xx21121.jpg> Details see: https://katalog.we-online.com/en/em/PHD_2_54_THT_DUAL_PIN_HEADER_6130XX21121 Updated by Yingchun,Shan 2019-10-16 2019 (C) Würth Elektronik; DATASHEET-URL: https://katalog.we-online.com/em/datasheet/61301821121.pdf; GENDER: Pin Header; IR: 3A; MATES: WR-PHD 2.54mm Angled DualSocket Header/Dual Socket Header/Dual Socket Header Bottom Entry/Dual Socket Header Bottom Entry Large/SMT Dual Socket Header/SMT Dual Socket Header Bottom Entry; PACKAGING: Bag; PART-NUMBER: 61301821121; PINS: 18; ROWS: Dual; TYPE: Board Stacker
J2 = Wurth_Connectors_WR-PHD:6130XX11121_61300411121: WR-PHD 2.54 mm THT Pin Header ARTICLE PROPERTIES: Pins:1;​ 2;​ 3;​ 4;​ 5;​ 6;​ 7;​ 8;​ 9;​ 10;​ 12;​ 13;​ 14;​ 15;​ 16;​ 18;​ 20;​ 22;​ 24;​ 25;​ 32;​ 36;​ 40 KIND PROPERTIES: Pitch：2.54 mm Quality Class:3 as per CECC 75 301-802 Rows：Single Gender：Pin Header Type：Straight MATERIAL PROPERTIES: Insulator Material :PBT Insulator Flammability Rating:UL94 V-0 Contact Material:Copper Alloy Contact Plating:Gold Contact Type:Stamped GENERAL INFORMATION Operating Temperature:-40 up to +105 °C Compliance:RoHS ELECTRICAL PROPERTIES: Rated Current:3 A IR 1:3 A Withstanding Voltage:500 V (AC) Contact Resistance:20 mΩ RISO:1000 MΩ CERTIFICATION UL Approval:E323964 PACKAGING PROPERTIES Packaging:Bag <https://katalog.we-online.com/media/images/v2/o33211v209%20Family_BTB_PHD_6130xx11121.jpg> Details see: https://katalog.we-online.com/en/em/PHD_2_54_THT_PIN_HEADER_6130XX11121 Updated by Yingchun,Shan 2019-10-16 2019 (C) Würth Elektronik; DATASHEET-URL: https://katalog.we-online.com/em/datasheet/61300411121.pdf; GENDER: Pin Header; IR: 3A; MATES: WR-PHD 2.54mm Angled Socket Header /SMT Socket Header/Socket Header; PACKAGING: Bag; PART-NUMBER: 61300411121; PINS: 4; ROWS: Single; TYPE: Straight
J3 = Wurth_Connectors_WR-PHD:6130XX11121_61300511121: WR-PHD 2.54 mm THT Pin Header ARTICLE PROPERTIES: Pins:1;​ 2;​ 3;​ 4;​ 5;​ 6;​ 7;​ 8;​ 9;​ 10;​ 12;​ 13;​ 14;​ 15;​ 16;​ 18;​ 20;​ 22;​ 24;​ 25;​ 32;​ 36;​ 40 KIND PROPERTIES: Pitch：2.54 mm Quality Class:3 as per CECC 75 301-802 Rows：Single Gender：Pin Header Type：Straight MATERIAL PROPERTIES: Insulator Material :PBT Insulator Flammability Rating:UL94 V-0 Contact Material:Copper Alloy Contact Plating:Gold Contact Type:Stamped GENERAL INFORMATION Operating Temperature:-40 up to +105 °C Compliance:RoHS ELECTRICAL PROPERTIES: Rated Current:3 A IR 1:3 A Withstanding Voltage:500 V (AC) Contact Resistance:20 mΩ RISO:1000 MΩ CERTIFICATION UL Approval:E323964 PACKAGING PROPERTIES Packaging:Bag <https://katalog.we-online.com/media/images/v2/o33211v209%20Family_BTB_PHD_6130xx11121.jpg> Details see: https://katalog.we-online.com/en/em/PHD_2_54_THT_PIN_HEADER_6130XX11121 Updated by Yingchun,Shan 2019-10-16 2019 (C) Würth Elektronik; DATASHEET-URL: https://katalog.we-online.com/em/datasheet/61300511121.pdf; GENDER: Pin Header; IR: 3A; MATES: WR-PHD 2.54mm Angled Socket Header /SMT Socket Header/Socket Header; PACKAGING: Bag; PART-NUMBER: 61300511121; PINS: 5; ROWS: Single; TYPE: Straight
J5 J9 = 6-pin-tht:6130XX21121_61300621121: WR-PHD 2.54 mm THT Dual Pin Header ARTICLE PROPERTIES: Pins:4;​ 6;​ 8;​ 10;​ 12;​ 14;​ 16;​ 18;​ 20;​ 22;​ 24;​ 26;​ 28;​ 30;​ 32;​ 34;​ 36;​ 40;​ 44;​ 64;​ 72;​ 80 KIND PROPERTIES: Pitch：2.54 mm Quality Class:3 as per CECC 75 301-802 Rows：Dual Gender：Pin Header Type：Board Stacker MATERIAL PROPERTIES: Insulator Material :PA6T Insulator Flammability Rating:UL94 V-0 Contact Material:Copper Alloy Contact Plating:Gold Contact Type:Stamped GENERAL INFORMATION Operating Temperature:-40 up to +105 °C Compliance:Lead free / RoHS ELECTRICAL PROPERTIES: Rated Current:3 A IR 1:3 A Withstanding Voltage:500 V (AC) Contact Resistance:20 mΩ RISO:1000 MΩ CERTIFICATION UL Approval:E323964 PACKAGING PROPERTIES Packaging:Bag <https://katalog.we-online.com/media/images/v2/o33215v209%20Family_WR-PHD_6130xx21121.jpg> Details see: https://katalog.we-online.com/en/em/PHD_2_54_THT_DUAL_PIN_HEADER_6130XX21121 Updated by Yingchun,Shan 2019-10-16 2019 (C) Würth Elektronik; DATASHEET-URL: https://katalog.we-online.com/em/datasheet/61300621121.pdf; GENDER: Pin Header; IR: 3A; MATES: WR-PHD 2.54mm Angled DualSocket Header/Dual Socket Header/Dual Socket Header Bottom Entry/Dual Socket Header Bottom Entry Large/SMT Dual Socket Header/SMT Dual Socket Header Bottom Entry; PACKAGING: Bag; PART-NUMBER: 61300621121; PINS: 6; ROWS: Dual; TYPE: Board Stacker
J6 J7 = Wurth_Connectors_WR-FAST:638207222005: WR-FAST 5.08 mm THT Male Header Vertical Blade 2863 KIND PROPERTIES Pitch 5.08 mm Gender Male MATERIAL PROPERTIES Insulator Material PC Insulator Flammability Rating UL94 V-0 Insulator Color Black Contact Material Steel Contact Plating Tin Contact Type Stamped GENERAL INFORMATION Operating Temperature -30 up to +120 °C Working Voltage 300 V (AC) Withstanding Voltage 1600 V (AC) Contact Resistance 20 mΩ RISO 5 MΩ IR 16 A CERTIFICATION cULus Approval E150931 PACKAGING PROPERTIES Packaging Box <https://www.we-online.com/catalog/media/o165124v209%20Family_ConFAST_638207222004.jpg> Details see: https://www.we-online.com/catalog/en/FAST_5_08_THT_MALE_VERTICAL_6382072220XX/ Updated by Ella Wu 2020-08-11 2020(C) Wurth Elektronik; CONTACT-RESISTANCE: 20mOhm; DATASHEET-URL: https://www.we-online.com/catalog/datasheet/638207222005.pdf; GENDER: Male; IR: 16A; MOUNT: THT; PART-NUMBER: 638207222005; PINS: 5; PITCH: 5.08mm; TYPE: Vertical; WORKING-VOLTAGE: 300V(AC)
R1-R7 R10 R13 R18 = resistor:R-EU_: RESISTOR, European symbol
RX1-RX4 = Wurth_Resistor_WRIS-KWKB:WRIS-KWKB_0612: WRIS-KWKB Thick Film Resistors High Power Current Sensing, Wide Terminal Characteristics Product series for high power current sensing up to 2 W Mounting style: SMT-Chip (wide terminal) Resistance range: 2.2 Ω ‒ 18 kΩ Resistance tolerance: ±1 %; ±5 % Rated Power: 0.75 W ‒ 2W TCR: ±200 ppm/°C Operating temperature: -55°C up to +155°C Sizes: 0612 / 1020 / 1225 Recommended soldering: Reflow soldering Applications Electric motor Camera Lighting control TV <https://katalog.we-online.com/media/images/v2/o135741v209%20Family_WRIS-KWKB.jpg> Details see: https://katalog.we-online.com/en/pbs/WRIS-KWKB Created by Ella Wu 2019-09-06 2019(C) Wurth Elektronik; DATASHEET-URL: https://katalog.we-online.de/pbs/datasheet/561020132023.pdf; IR: 39.9mA; MOUNT: SMT; PART-NUMBER: 561020132023; PRATED: 0.75W; TCR: ±200ppm/ °C; TECHNICAL-REFERENCE: KB06124700J304DAATP0000
U2 U3 = ITS4040DEPDXUMA1:ITS4040DEPDXUMA1: Power Switch/Driver 1:1 N-Channel 2.6A PG-TSDSO-14; DESCRIPTION: Power Switch/Driver 1:1 N-Channel 2.6A PG-TSDSO-14; DIGI-KEY_PART_NUMBER: ITS4040DEPDXUMA1TR-ND; MF: Infineon Technologies; MP: ITS4040DEPDXUMA1; PACKAGE: TSSOP-14 Infineon Technologies
U4 = TLE9250VSJ:TLE9250VSJ: TLE9250VSJ SOIC127P602X173-8N-V High Speed CAN FD Transceiver; ARTIKEL_NR: 545599
X1 = con-JST VH:S4P-VH: JST VH Series header 3.96mm pitch disconnectable crimp style connectors, horizontal (side entry type), 4 pins

## Net classes
1 GND: width 0.127 mm, clearance 0.127 mm to class 0

## Board
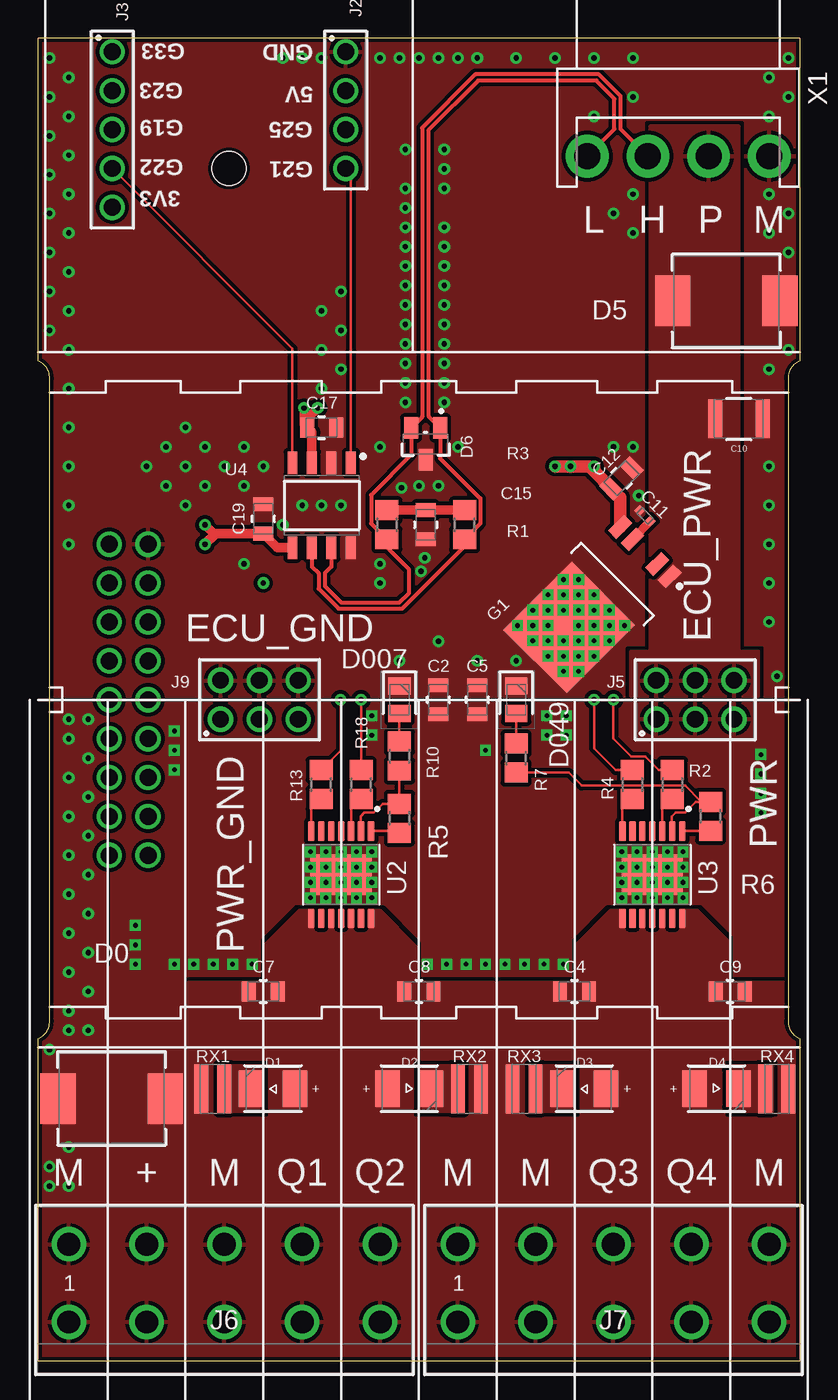
[diagram p6: board, top side]
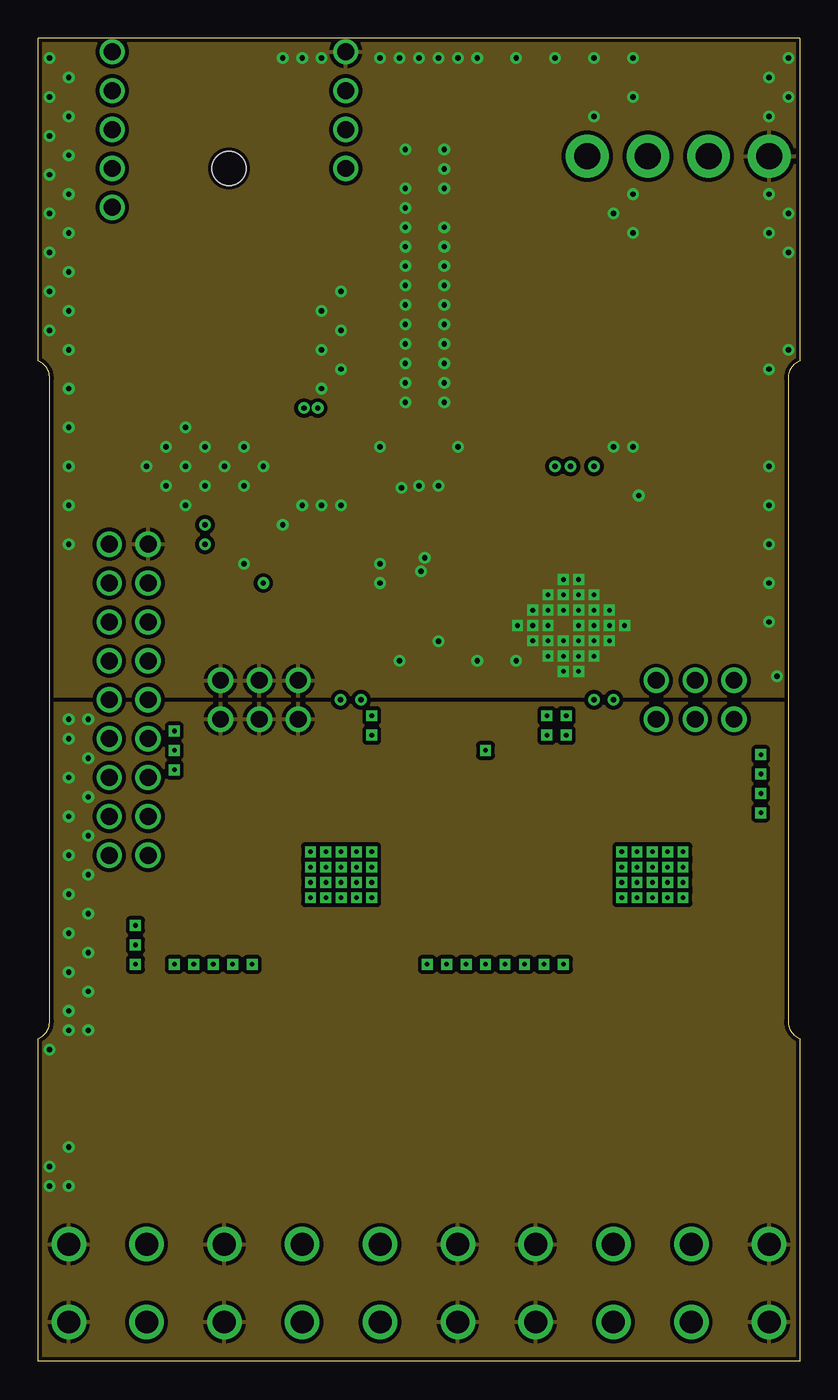
[diagram p7: board, inner layer Route2]
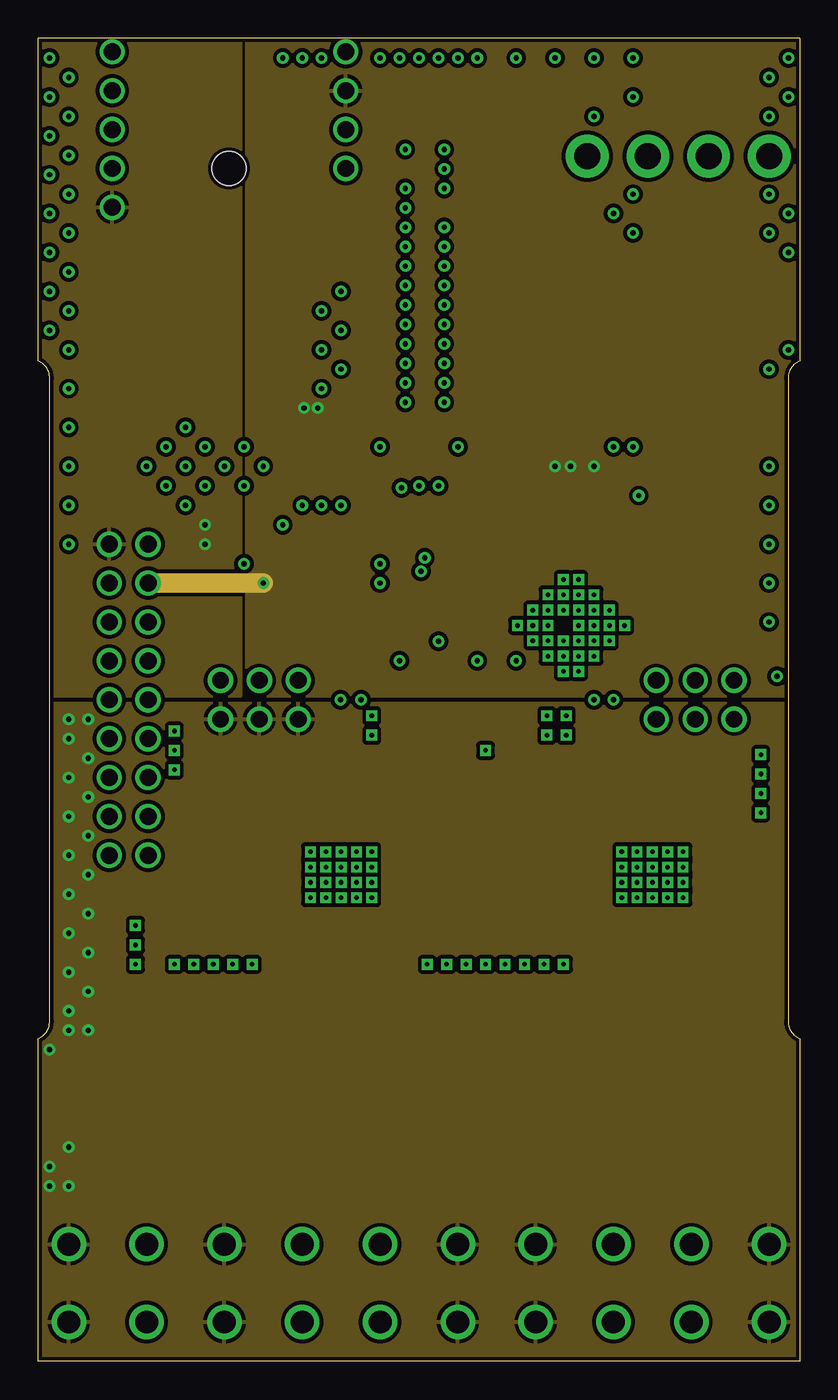
[diagram p8: board, inner layer Route15]
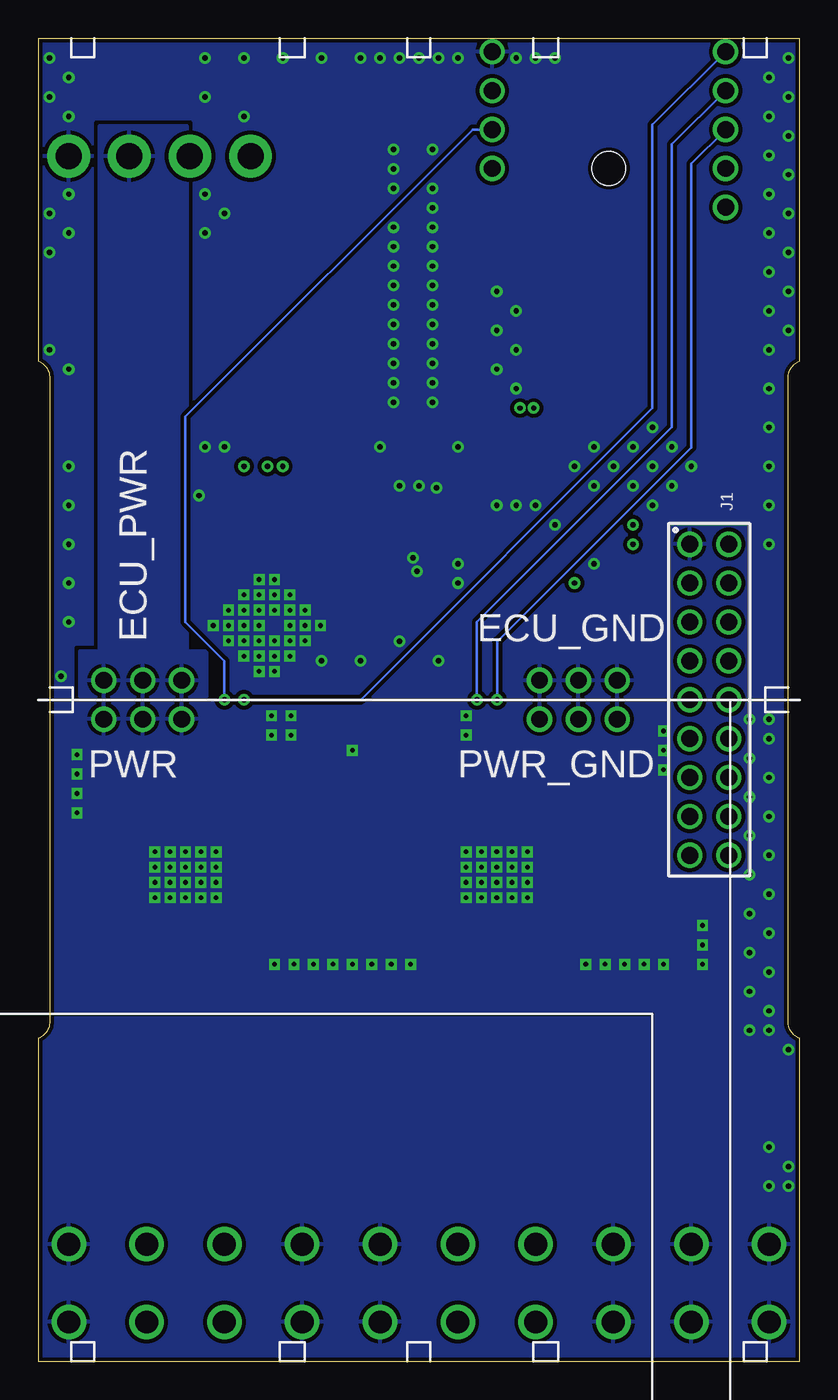
[diagram p9: board, bottom side, seen from below]

Size 49.7 x 86.4 mm. Coordinates in mm from the lower left corner, seen from the top.
Outline: 49.7,86.4 49.7,65.31 arc68 48.95,64.2 48.95,22.2 arc68 49.7,21.09 49.7,0 0,0 0,21.09 arc68 0.75,22.2 0.75,64.2 arc68 0,65.31 0,86.4 49.7,86.4
Copper layers (1+2*15+16): Top 0.035mm / dielectric 0.2mm / Route2 0.035mm / dielectric 1.5mm / Route15 0.035mm / dielectric 0.2mm / Bottom 0.035mm
Design rules "default *": minimum track width 6mil, minimum drill 0.3mm, track to track 6mil, track to pad 6mil, pad to pad 6mil, via to via 6mil, smd to smd 6mil, copper to edge 1mil, drill to drill 6mil, minimum pad ring 10mil, minimum via ring 8mil, stop-mask expansion 4mil, vias tented up to drill 2mm, thermal gap 10mil
Holes 2.2 mm at 12.45,77.9
tKeepout: area 48.2,42.4 to 49,44; area 0.8,42.4 to 1.5,44; area 0,63.3 to 49.7,65.9; area 0,20.5 to 49.7,23.1
bKeepout: area 0.8,42.4 to 2.2,44; area 47.5,42.4 to 49,44; area 2.2,85.2 to 3.7,86.4; area 15.8,85.2 to 17.4,86.4; area 24.1,85.2 to 25.6,86.4; area 32.3,85.2 to 34,86.4; area 46,85.2 to 47.5,86.4; area 46,0 to 47.5,1.2; area 32.3,0 to 34,1.2; area 24.1,0 to 25.6,1.2; area 15.8,0 to 17.4,1.2; area 2.2,0 to 3.7,1.2; 1 more areas

### Footprints (pad centres in the part's own frame; a part is rotated, then mirrored left to right if it is on the bottom)
WCAP-CSGP_0805_H0.8_R = smd 0.9 x 1.3: 1 -0.95,0; 2 0.95,0
WCAP-CSGP_1210_H2.5 = smd 0.9 x 2.5: 1 -1.55,0; 2 1.55,0
WCAP-CSGP_0402 = smd 0.5 x 0.5: 1 -0.5,0; 2 0.5,0
WCAP-CSGP_0805_H1.25_R = smd 0.9 x 1.3: 1 -0.95,0; 2 0.95,0
WE-TVSP_DO-214AB_BIDIRECTIONAL = smd 2.3 x 3.3: 1 -3.5,0; 2 3.5,0
WL-SMTW_3528 = smd 1.6 x 2.4: 1 -1.425,0; 2 1.425,0
WE-TVS_SOT23-3L = smd 1.4 x 0.9: 1 -1.05,0.95; 2 -1.05,-0.95; 3 1.05,0
DIOC2012X95N = smd 1.1 x 1.45: 1 -0.9,0; 2 0.9,0
INF-PG-TO252-5-11_L_1PRIMARY = smd 1.45 x 0.75: 1 -4.7,2.28; 2 -4.7,1.14; 4 -4.7,-1.14; 5 -4.7,-2.28 | smd 6.3 x 5.85: 3 2.3,0
61301821121 = drill 1.1: 1 -10.16,-1.27; 2 -10.16,1.27; 3 -7.62,-1.27; 4 -7.62,1.27; 5 -5.08,-1.27; 6 -5.08,1.27; 7 -2.54,-1.27; 8 -2.54,1.27; 9 0,-1.27; 10 0,1.27; 11 2.54,-1.27; 12 2.54,1.27; 13 5.08,-1.27; 14 5.08,1.27; 15 7.62,-1.27; 16 7.62,1.27; 17 10.16,-1.27; 18 10.16,1.27
61300411121 = drill 1.1: 1 -3.81,0; 2 -1.27,0; 3 1.27,0; 4 3.81,0
61300511121 = drill 1.1: 1 -5.08,0; 2 -2.54,0; 3 0,0; 4 2.54,0; 5 5.08,0
61300621121 = drill 1.1: 1 -2.54,-1.27; 2 -2.54,1.27; 3 0,-1.27; 4 0,1.27; 5 2.54,-1.27; 6 2.54,1.27
638207222005 = drill 1.5: 1 -10.16,2.54; 2 -5.08,2.54; 3 0,2.54; 4 5.08,2.54; 5 10.16,2.54; A1 -10.16,-2.54; A2 -5.08,-2.54; A3 0,-2.54; A4 5.08,-2.54; A5 10.16,-2.54
R0805 = smd 1.3 x 1.5: 1 -0.95,0; 2 0.95,0
WRIS-KWKB_0612 = smd 3.2 x 0.9: 1 0,0.75; 2 0,-0.75
SOP65P600X115-15N = smd 1.31 x 0.45: 1 -2.85,1.95; 2 -2.85,1.3; 3 -2.85,0.65; 4 -2.85,0; 5 -2.85,-0.65; 6 -2.85,-1.3; 7 -2.85,-1.95; 8 2.85,-1.95; 9 2.85,-1.3; 10 2.85,-0.65; 11 2.85,0; 12 2.85,0.65; 13 2.85,1.3; 14 2.85,1.95 | smd 2.65 x 4: 15 0,0
SOIC127P602X173-8N-V = smd 1.47 x 0.65: 1 -2.765,1.905; 2 -2.765,0.635; 3 -2.765,-0.635; 4 -2.765,-1.905; 5 2.765,-1.905; 6 2.765,-0.635; 7 2.765,0.635; 8 2.765,1.905
S4P-VH = drill 1.7 pad 2.794: 1 -5.94,0; 2 -1.98,0; 3 1.98,0; 4 5.94,0

### Placement (x,y rotation side)
C2  26.12,43.2 90 top
C4  35.01,24.15 0 top
C5  28.66,43.2 90 top
C7  14.69,24.15 0 top
C8  24.85,24.15 0 top
C9  45.17,24.15 0 top
C10  45.74,61.54 180 top
C11  39.61,55.21 135 top
C12  38.07,57.67 225 top
C15  25.29,54.63 270 top
C17  18.5,60.98 0 top
C19  14.69,55.01 90 top
D0  4.78,17.17 0 top
D1  15.33,17.8 0 top
D2  24.21,17.8 180 top
D3  35.65,17.8 0 top
D4  44.28,17.8 180 top
D5  44.92,69.23 180 top
D6  25.29,59.91 270 top
D007  23.58,43.2 270 top
D049  31.2,43.2 270 top
G1  36.28,49.55 225 top
J1  5.9,43.2 270 bottom
J2  20.07,81.71 270 top
J3  4.83,80.44 270 top
J5  42.88,43.2 0 top
J6  12.15,5.1 0 top
J7  37.55,5.1 0 top
J9  14.44,43.2 0 top
R1  22.75,54.63 270 top
R2  41.39,37.66 270 top
R3  27.83,54.63 270 top
R4  38.79,37.66 270 top
R5  23.58,35.45 270 top
R6  43.9,35.58 270 top
R7  31.2,39.39 270 top
R10  23.58,39.52 270 top
R13  18.47,37.66 270 top
R18  21.07,37.66 270 top
RX1  11.39,17.8 90 top
RX2  28.15,17.8 90 top
RX3  31.71,17.8 90 top
RX4  48.22,17.8 90 top
U2  19.77,31.77 270 top
U3  40.09,31.77 270 top
U4  18.5,55.9 270 top
X1  41.78,78.7 180 top

### Tracks (layer width: path | path; a pad name or v marks a point on that pad's centre or on a via)
+3V3  (via drill 0.35)
  Top 0.61: U4.5 15.62,53.14 C19.1 11.58,54.06 11.52,54 | 11.52,54 v10.88,53.36 | 11.52,54 v10.88,54.63
  pour Route15 (isolate 0.254, rank 2): -0.35,43.4 -0.35,86.4 13.22,86.4 13.22,43.4
+5V  (via drill 0.35)
  Top 0.61: U4.3 17.87,60.67 C17.1 | C17.1 17.36,61.17 v17.36,62.25 | C17.1 17.55,61.55 v18.25,62.25
  Top 0.813: C12.2 36.28,58.12 v36.28,58.44 | C12.2 35.96,58.44 v33.74,58.44 | G1.5 37.99,56.41 C12.2
  Route15 1.27: v14.69,50.82 J1.3
  other vias: 34.74,58.44
  pour Route15 (isolate 0.254, rank 2): 13.62,43.4 13.62,86.4 50.05,86.4 50.05,43.4
CAN1_RXD
  Top 0.152: J3.4 16.59,66.14 U4.4
CAN1_TXD
  Top 0.152: J2.4 20.41,77.56 U4.1
CAN_N
  Top 0.254: X1.4 37.62,80.48 37.62,82.45 36.43,83.64 28.71,83.64 25.46,80.39 25.46,61.74 D6.1 26.24,58.97 28.86,56.35 28.86,54.71 R3.2 27.83,53.23 23.75,49.14 19.6,49.14 18.3,50.45 18.3,51.46 17.87,51.89 U4.6
CAN_P
  Top 0.254: X1.3 38.02,80.48 38.02,82.62 36.6,84.04 28.54,84.04 25.05,80.55 25.05,61.67 D6.2 24.34,59.2 21.72,56.58 21.72,54.71 R1.2 22.75,53.17 24.21,51.71 24.21,50.19 23.58,49.55 19.77,49.55 18.7,50.62 18.7,51.46 19.14,51.89 U4.7
ECU_GND  (via drill 0.3, 0.35)
  other vias: 24.85,57.17 26.12,57.17 25.23,52.47 24.98,51.58 23.71,57.04 26.5,79.14 26.5,77.87 23.96,75.33 23.96,74.06 23.96,72.79 23.96,71.52 23.96,70.25 23.96,68.98 23.96,67.71 23.96,66.44 23.96,65.17 23.96,63.9 23.96,62.63 26.5,62.63 26.5,63.9 26.5,72.79 26.5,71.52 26.5,70.25 26.5,68.98 26.5,67.71 26.5,66.44 26.5,65.17 22.31,59.71 27.39,59.71 19.77,64.79 18.5,63.52 18.5,66.06 19.77,67.33 18.5,68.6 19.77,69.87 18.5,55.9 19.77,55.9 17.23,55.9 22.31,52.09 22.31,50.82 14.69,58.44 13.42,59.71 15.96,54.63 13.42,57.17 10.88,59.71 12.15,58.44 9.61,60.98 7.07,58.44 8.34,57.17 9.61,55.9 13.42,52.09 0.72,85.11 0.72,82.57 1.99,83.84 1.99,81.3 0.72,80.03 1.99,78.76 0.72,77.49 1.99,76.22 0.72,74.95 1.99,73.68 0.72,72.41 1.99,71.14 0.72,69.87 1.99,68.6 0.72,67.33 1.99,66.06 1.99,63.52 1.99,60.98 48.98,85.11 47.71,83.84 48.98,82.57 47.71,81.3 47.71,76.22 48.98,74.95 47.71,73.68 48.98,72.41 48.98,66.06 47.71,64.79 47.71,58.44 47.71,55.9 1.99,58.44 1.99,55.9 1.99,53.36 47.71,53.36 47.71,50.82 47.71,48.28 48.22,44.72 38.82,73.68 37.55,74.95 38.82,76.22 36.28,81.3 38.82,82.57 38.82,85.11 36.28,85.11 33.74,85.11 31.2,85.11 28.66,85.11 22.31,85.11 24.85,85.11 27.39,85.11 26.12,85.11 23.58,85.11 18.5,85.11 17.23,85.11 15.96,85.11 36.28,49.05 36.28,50.05 35.28,50.05 35.28,49.05 35.28,48.05 35.28,47.05 36.28,47.05 36.28,48.05 37.28,48.05 37.28,49.05 37.28,47.05 36.28,46.05 35.28,45.05 34.28,49.05 33.28,49.05 32.28,49.05 31.28,48.05 32.28,47.05 33.28,46.05 34.28,45.05 34.28,46.05 35.28,46.05 34.28,47.05 33.28,47.05 33.28,48.05 32.28,48.05 33.28,50.05 34.28,51.05 34.28,50.05 35.28,51.05 38.28,48.05 37.55,59.71 38.82,59.71 39.2,56.54 31.2,45.74 28.66,45.74 26.12,47.01 23.58,45.74 26.5,74.06 26.5,76.6 23.96,76.6 23.96,79.14 8.34,59.71 9.61,58.44 10.88,57.17
  pour Top (isolate 0.254, rank 2): -0.35,43.4 -0.35,86.4 50.05,86.4 50.05,43.4
  pour Bottom (isolate 0.254, rank 2): -0.35,43.4 -0.35,86.4 50.05,86.4 50.05,43.4
  pour Route2 (isolate 0.254, rank 2): -0.35,43.4 -0.35,86.4 50.05,86.4 50.05,43.4
ECU_PWR
  pour Top (isolate 0.254): 39.95,43.4 39.95,80.68 45.74,80.68 45.74,43.4
  pour Bottom (isolate 0.254): 39.95,43.4 39.95,80.68 45.74,80.68 45.74,43.4
  pour Top (isolate 0.254): 38.68,43.4 38.68,46.39 47.01,46.39 47.01,43.4
  pour Bottom (isolate 0.254): 38.68,43.4 38.68,46.39 47.01,46.39 47.01,43.4
N$1
  pour Top (isolate 0.254): 45.17,19.32 47.96,19.32 47.96,16.28 45.17,16.28
N$2
  Top 0.152: U3.3 40.74,36.06 R2.2
N$3
  Top 0.152: U3.1 R6.2
N$4
  Top 0.152: U3.7 38.14,36.06 R4.2
N$5
  Top 0.152: U2.1 23.46,34.62 R5.2
N$6
  pour Top (isolate 0.254): 24.85,19.32 27.64,19.32 27.64,16.28 24.85,16.28
N$7
  Top 0.508: C11.1 38.8,53.7 G1.4
N$8
  pour Top (isolate 0.254): 11.9,19.32 14.69,19.32 14.69,16.28 11.9,16.28
N$9
  pour Top (isolate 0.254): 32.22,19.32 35.01,19.32 35.01,16.28 32.22,16.28
N$10
  Top 0.152: U2.3 20.42,36.06 R18.2
N$11
  Top 0.152: D049.2 R7.1
N$12
  Top 0.152: D007.2 R10.1
N$13
  Top 0.152: U3.2 41.36,34.65 41.36,35.58 41.61,35.83 42.23,35.83 42.93,36.53 R6.1 43.3,36.53 42.23,37.59 35.47,37.59 34.62,38.44 R7.2
N$14
  Top 0.152: U2.7 17.82,36.06 R13.2
N$15
  Top 0.152: U2.2 21.04,34.65 21.04,35.58 21.29,35.83 21.92,35.83 22.48,36.4 R5.1 R10.2
N$17
  Top 0.61: R1.1 C15.1 R3.1
PWR  (via drill 0.3)
  other vias: 19.77,31.27 19.77,32.27 19.77,33.27 19.77,30.27 20.77,30.27 21.77,30.27 18.77,30.27 17.77,30.27 17.77,31.27 17.77,32.27 17.77,33.27 18.77,33.27 18.77,32.27 18.77,31.27 20.77,31.27 20.77,32.27 20.77,33.27 21.77,33.27 21.77,32.27 21.77,31.27 40.09,32.27 40.09,33.27 40.09,31.27 40.09,30.27 41.09,30.27 41.09,31.27 41.09,32.27 41.09,33.27 42.09,33.27 42.09,32.27 42.09,31.27 42.09,30.27 39.09,30.27 39.09,31.27 39.09,32.27 39.09,33.27 38.09,33.27 38.09,32.27 38.09,31.27 38.09,30.27 25.39,25.92 26.66,25.92 27.93,25.92 29.2,25.92 30.47,25.92 31.74,25.92 33.01,25.92 34.28,25.92 13.96,25.92 12.69,25.92 11.42,25.92 10.15,25.92 8.88,25.92 6.34,25.92 6.34,27.19 6.34,28.46 8.88,41.16 8.88,39.89 8.88,38.62 29.2,39.89 47.17,39.62 47.17,38.35 47.17,37.08 47.17,35.81 33.2,42.16 34.47,42.16 34.47,40.89 33.2,40.89 21.77,40.89 21.77,42.16
  pour Top (isolate 0.254, rank 3): 4.73,22.88 4.73,43 50.05,43 50.05,22.88
  pour Top (isolate 0.254, rank 2): 4.73,-1.25 4.73,25.8 9.41,25.8 9.41,-1.25
  pour Bottom (isolate 0.254, rank 3): 4.73,22.88 4.73,43 50.05,43 50.05,22.88
  pour Bottom (isolate 0.254, rank 2): 4.73,-1.25 4.73,25.8 9.41,25.8 9.41,-1.25
PWR_GND  (via drill 0.35)
  other vias: 1.99,11.45 0.72,11.45 0.72,12.72 1.99,13.99 0.72,20.34 1.99,21.61 3.26,24.15 1.99,22.88 3.26,21.61 1.99,25.42 3.26,26.69 1.99,27.96 3.26,29.23 1.99,30.5 3.26,31.77 1.99,33.04 3.26,34.31 1.99,35.58 3.26,36.85 1.99,38.12 3.26,39.39 1.99,40.66 3.26,41.93 1.99,41.93
  pour Top (isolate 0.254, rank 2): 9.81,-1.25 9.81,24.79 14.49,24.79 14.49,-1.25
  pour Top (isolate 0.254, rank 2): 25.05,24.79 29.73,24.79 29.73,-1.25 25.05,-1.25
  pour Top (isolate 0.254, rank 2): 30.13,24.79 34.81,24.79 34.81,-1.25 30.13,-1.25
  pour Top (isolate 0.254, rank 2): 45.37,24.79 50.05,24.79 50.05,-1.25 45.37,-1.25
  pour Top (isolate 0.254, rank 2): -0.35,-1.25 -0.35,43 4.33,43 4.33,-1.25
  pour Route2 (isolate 0.254, rank 4): -0.35,-1.25 -0.35,43 50.05,43 50.05,-1.25
  pour Route15 (isolate 0.254, rank 4): -0.35,-1.25 -0.35,43 50.05,43 50.05,-1.25
  pour Bottom (isolate 0.254, rank 4): -0.35,-1.25 -0.35,43 50.05,43 50.05,-1.25
Q1
  pour Top (isolate 0.254, rank 2): 14.89,-1.25 14.89,27.33 17.03,29.46 19.57,29.46 19.57,-1.25
Q1C  (via drill 0.35)
  Top 0.152: v19.74,43.2 19.74,39.88 R13.1
  Bottom 0.152: v19.74,43.2 19.74,47.01 7.07,59.68 7.07,78.2 J3.3
Q2
  pour Top (isolate 0.254, rank 2): 19.97,29.46 22.31,29.46 24.65,27.12 24.65,-1.25 19.97,-1.25
Q2C  (via drill 0.35)
  Top 0.152: R18.1 v21.07,43.2
  Bottom 0.152: v21.07,43.2 21.07,48.28 8.34,61.01 8.34,79.47 J3.2
Q3
  pour Top (isolate 0.254, rank 2): 35.21,-1.25 35.21,27.33 37.35,29.46 39.89,29.46 39.89,-1.25
Q3C  (via drill 0.35)
  Top 0.152: R4.1 37.69,38.61 36.28,40.03 v36.28,43.2
  Bottom 0.152: J3.1 9.61,80.74 9.61,62.25 28.66,43.2 v36.28,43.2
Q4
  pour Top (isolate 0.254, rank 2): 40.29,29.46 43.04,29.46 44.97,27.53 44.97,-1.25 40.29,-1.25
Q4C  (via drill 0.35)
  Top 0.152: R2.1 40.51,38.61 39.64,39.49 38.72,39.49 37.55,40.66 v37.55,43.2
  Bottom 0.152: J2.3 21.34,80.44 40.09,61.69 40.09,48.28 37.55,45.74 v37.55,43.2

### Text on the board
tPlace: G33 | GND | G23 | 5V | G19 | G25 | G22 | G21 | 3V3
tNames: L | H | P | M | ECU_GND | ECU_PWR | PWR | PWR_GND | M | + | M | Q1 | Q2 | M | M | Q3 | Q4 | M
bNames: ECU_GND | ECU_PWR | PWR_GND | PWR